# EAGLE design RX621_GREEEEN (EAGLE 5.11)
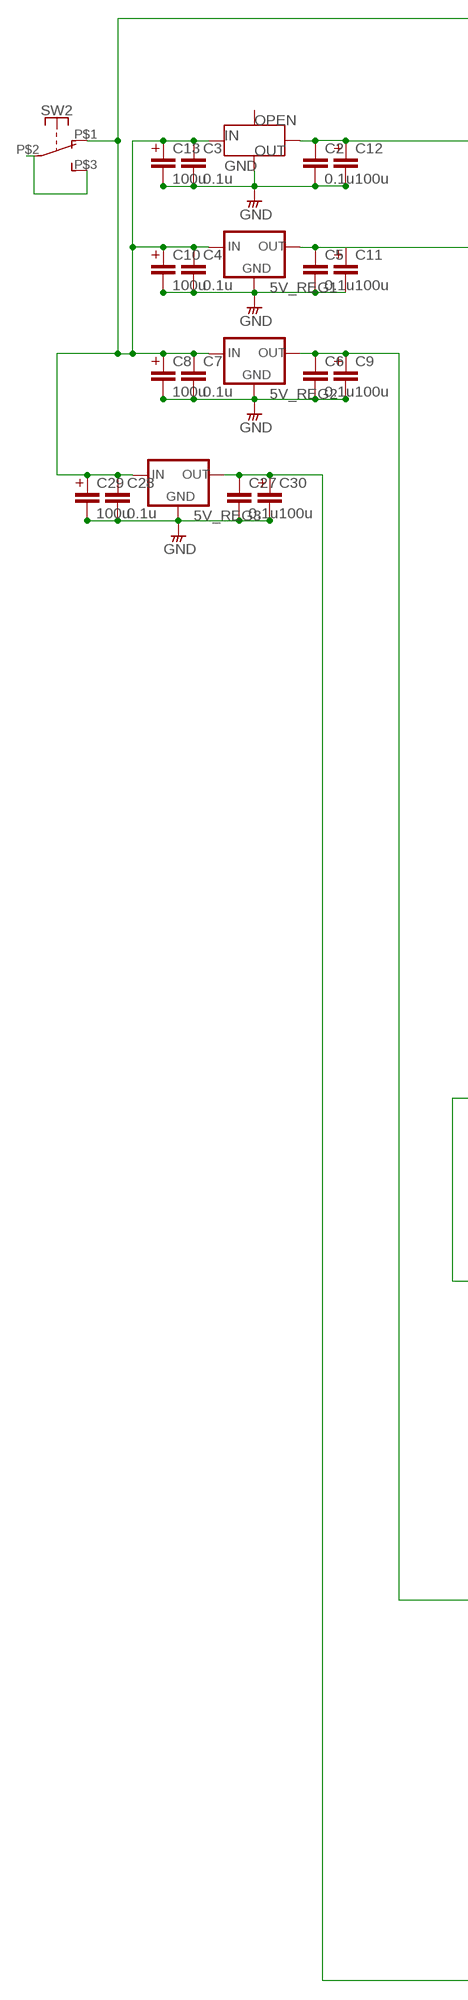
[diagram p0: schematic, sheet 1, part 1 of 2]
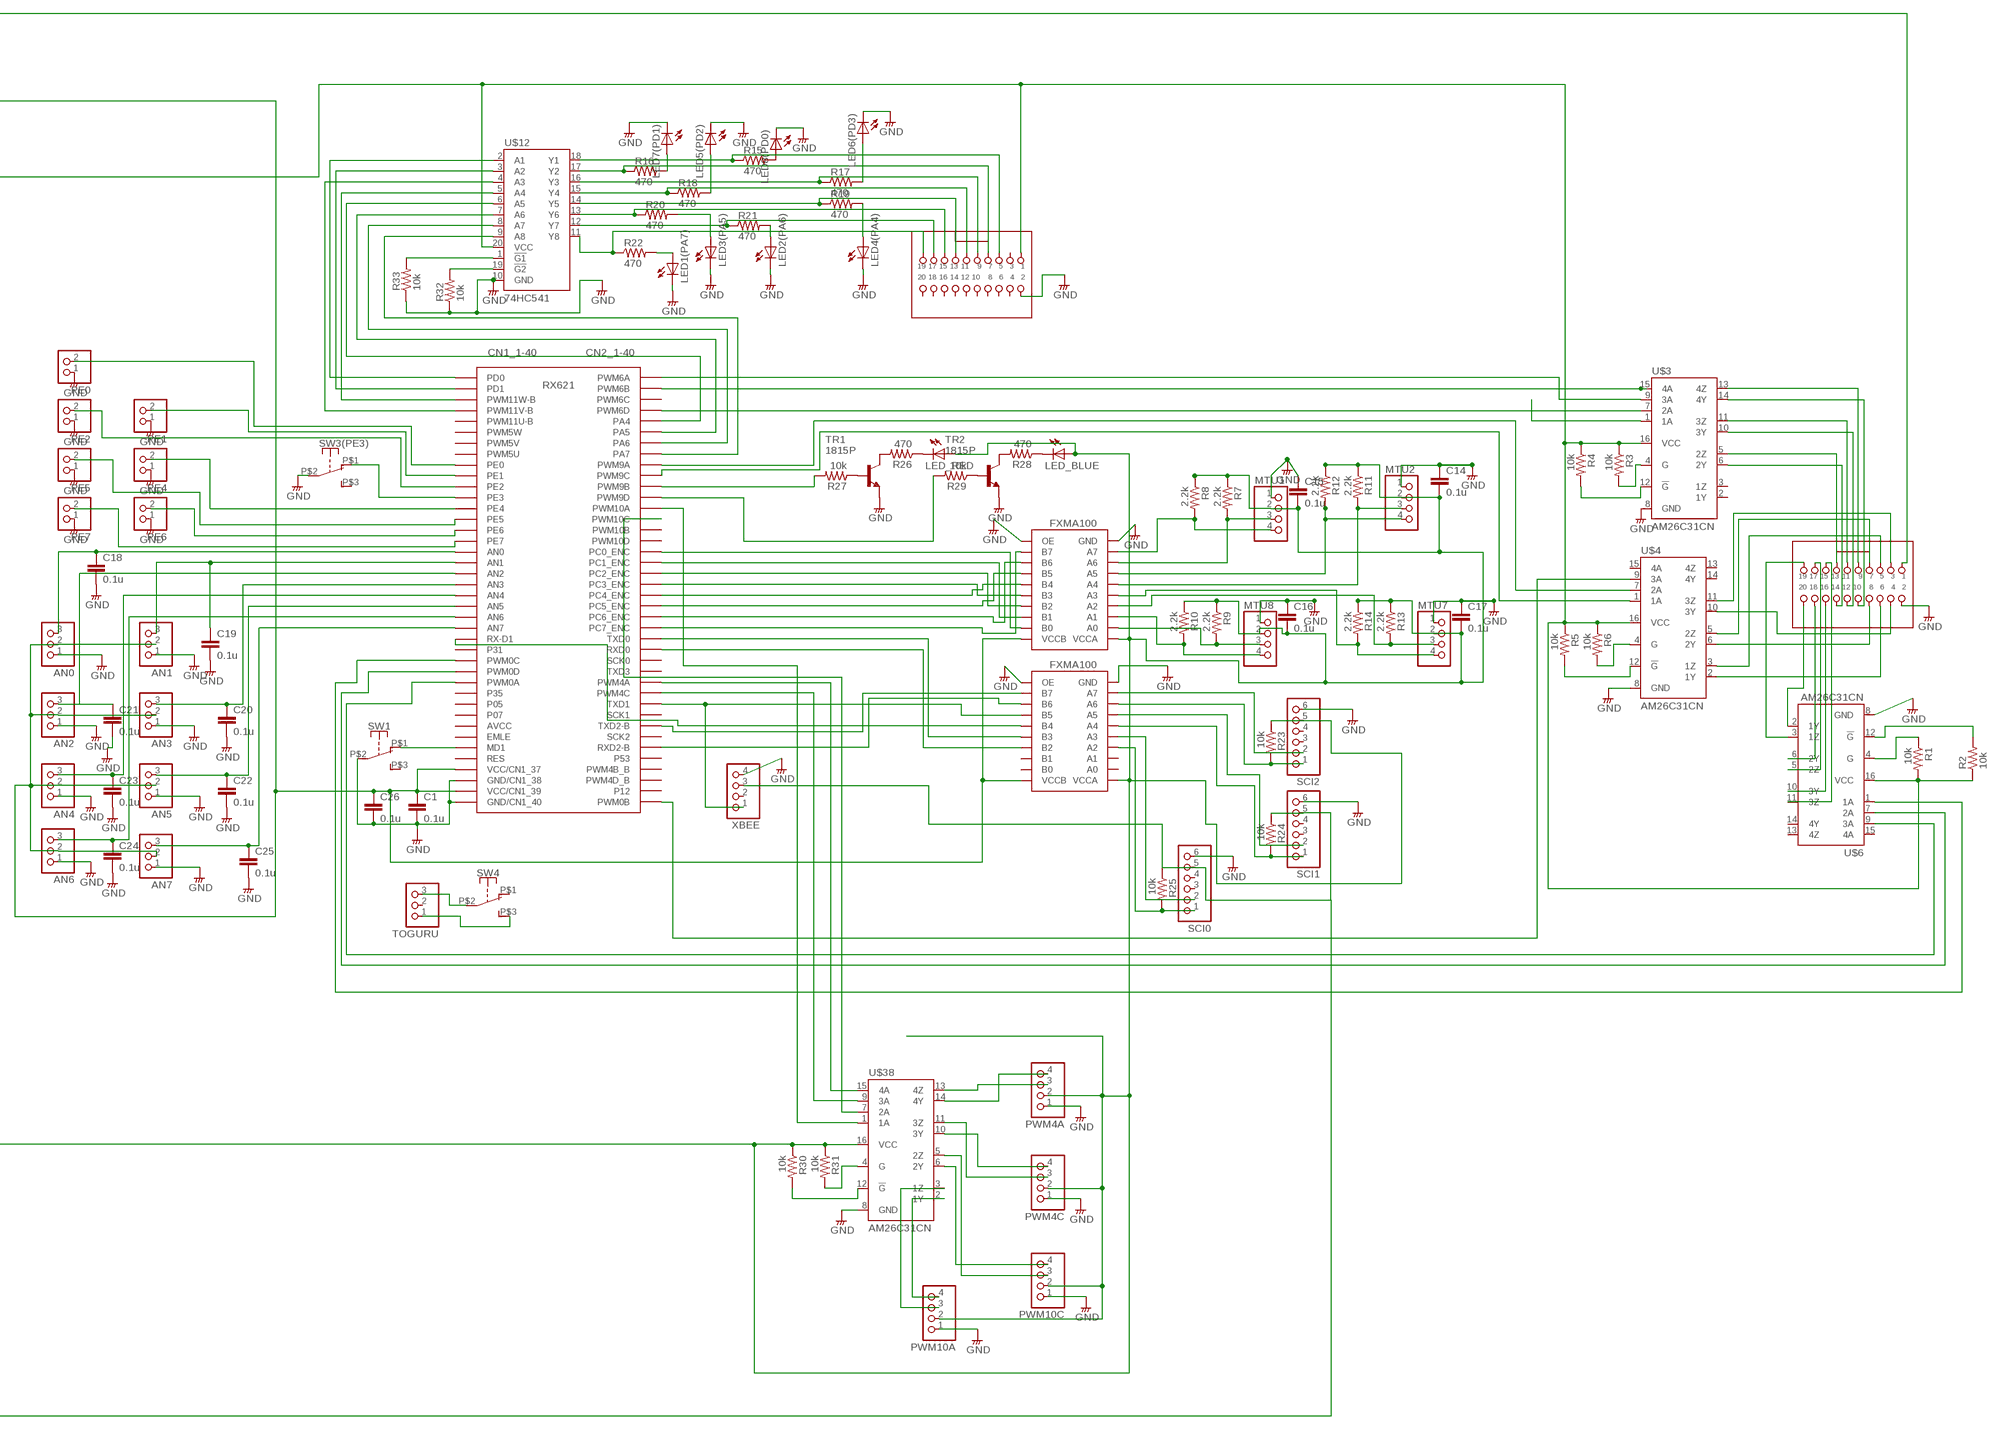
[diagram p1: schematic, sheet 1, part 2 of 2]

## Parts
3.3V_REG  PQ3RD23  [PQ3D23]
5V_REG1  78  [78XX]
5V_REG2  78  [78XX]
5V_REG3  78  [78XX]
AN0  PINHD-1X31*03_P  [1*03_P]
AN1  PINHD-1X31*03_P  [1*03_P]
AN2  PINHD-1X31*03_P  [1*03_P]
AN3  PINHD-1X31*03_P  [1*03_P]
AN4  PINHD-1X31*03_P  [1*03_P]
AN5  PINHD-1X31*03_P  [1*03_P]
AN6  PINHD-1X31*03_P  [1*03_P]
AN7  PINHD-1X31*03_P  [1*03_P]
C1  0.1u  MLCCMLCC_25_P  [MLCC_25_P]
C2  0.1u  MLCC-1  [MLCC_25]
C3  0.1u  MLCC-1  [MLCC_25]
C4  0.1u  MLCC-1  [MLCC_25]
C5  0.1u  MLCC-1  [MLCC_25]
C6  0.1u  MLCC-1  [MLCC_25]
C7  0.1u  MLCC-1  [MLCC_25]
C8  100u  CAPACITOR-2  [C_0.2]
C9  100u  CAPACITOR-2  [C_0.2]
C10  100u  CAPACITOR-2  [C_0.2]
C11  100u  CAPACITOR-2  [C_0.2]
C12  100u  CAPACITOR-2  [C_0.2]
C13  100u  CAPACITOR-2  [C_0.2]
C14  0.1u  MLCCMLCC_25_P  [MLCC_25_P]
C15  0.1u  MLCCMLCC_25_P  [MLCC_25_P]
C16  0.1u  MLCCMLCC_25_P  [MLCC_25_P]
C17  0.1u  MLCCMLCC_25_P  [MLCC_25_P]
C18  0.1u  MLCCMLCC_25_P  [MLCC_25_P]
C19  0.1u  MLCCMLCC_25_P  [MLCC_25_P]
C20  0.1u  MLCCMLCC_25_P  [MLCC_25_P]
C21  0.1u  MLCCMLCC_25_P  [MLCC_25_P]
C22  0.1u  MLCCMLCC_25_P  [MLCC_25_P]
C23  0.1u  MLCCMLCC_25_P  [MLCC_25_P]
C24  0.1u  MLCCMLCC_25_P  [MLCC_25_P]
C25  0.1u  MLCCMLCC_25_P  [MLCC_25_P]
C26  0.1u  MLCCMLCC_25_P  [MLCC_25_P]
C27  0.1u  MLCC-1  [MLCC_25]
C28  0.1u  MLCC-1  [MLCC_25]
C29  100u  CAPACITOR-2  [C_0.2]
C30  100u  CAPACITOR-2  [C_0.2]
LED1(PA7)  LEDLED3MM_P  [LED3MM_P]
LED2(PA6)  LEDLED3MM_P  [LED3MM_P]
LED3(PA5)  LEDLED3MM_P  [LED3MM_P]
LED4(PA4)  LEDLED3MM_P  [LED3MM_P]
LED5(PD2)  LEDLED3MM_P  [LED3MM_P]
LED6(PD3)  LEDLED3MM_P  [LED3MM_P]
LED7(PD1)  LEDLED3MM_P  [LED3MM_P]
LED8(PD0)  LEDLED3MM_P  [LED3MM_P]
LED_BLUE  LED3MM  [LED3MM]
LED_RED  LED3MM  [LED3MM]
MTU1  PINHD-1X41*04_P  [1*04_P]
MTU2  PINHD-1X41*04_P  [1*04_P]
MTU7  PINHD-1X41*04_P  [1*04_P]
MTU8  PINHD-1X41*04_P  [1*04_P]
PE0  PINHD-1X21*02_P  [1*02_P]
PE1  PINHD-1X21*02_P  [1*02_P]
PE2  PINHD-1X21*02_P  [1*02_P]
PE4  PINHD-1X21*02_P  [1*02_P]
PE5  PINHD-1X21*02_P  [1*02_P]
PE6  PINHD-1X21*02_P  [1*02_P]
PE7  PINHD-1X21*02_P  [1*02_P]
PWM4A  PINHD-1X41*04_P  [1*04_P]
PWM4C  PINHD-1X41*04_P  [1*04_P]
PWM10A  PINHD-1X41*04_P  [1*04_P]
PWM10C  PINHD-1X41*04_P  [1*04_P]
R1  10k  RESISTORS  [R_0.2_P]
R2  10k  RESISTORS  [R_0.2_P]
R3  10k  RESISTORSR_0.4_P  [R_0.4_P]
R4  10k  RESISTORSR_0.4_P  [R_0.4_P]
R5  10k  RESISTORSR_0.4_P  [R_0.4_P]
R6  10k  RESISTORSR_0.4_P  [R_0.4_P]
R7  2.2k  RESISTORS  [R_0.2_P]
R8  2.2k  RESISTORS  [R_0.2_P]
R9  2.2k  RESISTORS  [R_0.2_P]
R10  2.2k  RESISTORS  [R_0.2_P]
R11  2.2k  RESISTORS  [R_0.2_P]
R12  2.2k  RESISTORS  [R_0.2_P]
R13  2.2k  RESISTORS  [R_0.2_P]
R14  2.2k  RESISTORS  [R_0.2_P]
R15  470  RESISTORS  [R_0.2_P]
R16  470  RESISTORS  [R_0.2_P]
R17  470  RESISTORS  [R_0.2_P]
R18  470  RESISTORS  [R_0.2_P]
R19  470  RESISTORS  [R_0.2_P]
R20  470  RESISTORS  [R_0.2_P]
R21  470  RESISTORS  [R_0.2_P]
R22  470  RESISTORS  [R_0.2_P]
R23  10k  RESISTORSR_0.4_P  [R_0.4_P]
R24  10k  RESISTORSR_0.4_P  [R_0.4_P]
R25  10k  RESISTORSR_0.4_P  [R_0.4_P]
R26  470  RESISTORS  [R_0.2_P]
R27  10k  RESISTORS  [R_0.2_P]
R28  470  RESISTORS  [R_0.2_P]
R29  10k  RESISTORS  [R_0.2_P]
R30  10k  RESISTORSR_0.4_P  [R_0.4_P]
R31  10k  RESISTORSR_0.4_P  [R_0.4_P]
R32  10k  RESISTORS  [R_0.2_P]
R33  10k  RESISTORS  [R_0.2_P]
SCI0  PINHD-1X61*06_P  [1*06_P]
SCI1  PINHD-1X61*06_P  [1*06_P]
SCI2  PINHD-1X61*06_P  [1*06_P]
SW1  TOGGLE9450-1_P  [9450-1_P]
SW2  TOGGLE9450-1_P  [9450-1_P]
SW3(PE3)  TOGGLE9450-1_P  [9450-1_P]
SW4  TOGGLE9450-1_P  [9450-1_P]
TOGURU  PINHD-1X31*03_P  [1*03_P]
TR1  1815P  [TO92A_P]
TR2  1815P  [TO92A_P]
U$1  RX621_GREEN  [RX621_GREEN]
U$2  OMRON_XG4  [OMRON_XG4]
U$3  AM26C31CN  26C31DIL16_P  [DIL16_P]
U$4  AM26C31CN  26C31DIL16_P  [DIL16_P]
U$6  AM26C31CN  26C31DIL16_P  [DIL16_P]
U$9  FXMA100  [FXMA100]
U$12  74HC541  [DIL20_P]
U$13  OMRON_XG4  [OMRON_XG4]
U$24  FXMA100  [FXMA100]
U$38  AM26C31CN  26C31DIL16_P  [DIL16_P]
XBEE  PINHD-1X41*04_P  [1*04_P]

## Nets
AN2: AN1.3 C19.1 U$1.CN1_18(AN1)
AN3: AN2.3 C21.1 U$1.CN1_19(AN2)
AN6: AN6.3 C24.1 U$1.CN1_23(AN6)
GND: 3.3V_REG.GND(GBD) 5V_REG1.P$2(GND) 5V_REG2.P$2(GND) 5V_REG3.P$2(GND) AN0.1 AN1.1 AN2.1 AN3.1 AN4.1 AN5.1 AN6.1 AN7.1 C1.2 C2.2 C3.2 C4.2 C5.2 C6.2 C7.2 C8.P$2 C9.P$2 C10.P$2 C11.P$2 C12.P$2 C13.P$2 C14.1 C15.1 C16.1 C17.1 C18.2 C19.2 C20.2 C21.2 C22.2 C23.2 C24.2 C25.2 C26.2 C27.2 C28.2 C29.P$2 C30.P$2 LED1(PA7).K(C) LED2(PA6).K(C) LED3(PA5).K(C) LED4(PA4).K(C) LED5(PD2).K(C) LED6(PD3).K(C) LED7(PD1).K(C) LED8(PD0).K(C) MTU1.1 MTU2.1 MTU7.1 MTU8.1 PE0.1 PE1.1 PE2.1 PE4.1 PE5.1 PE6.1 PE7.1 PWM4A.1 PWM4C.1 PWM10A.1 PWM10C.1 R32.1 R33.1 SCI0.6 SCI1.6 SCI2.6 SW1.P$2(P) SW3(PE3).P$2(P) TR1.E TR2.E U$1.CN1_38(GND/CN1_38) U$1.CN1_40(GND/CN1_40) U$2.P$2 U$3.8(GND) U$4.8(GND) U$6.8(GND) U$9.GND U$9.OE U$12.10(GND) U$13.P$2 U$24.GND U$24.OE U$38.8(GND) XBEE.4
N$1: SW1.P$1(O) U$1.CN1_35(MD1)
N$2: U$1.P$13(PWM10A) U$38.1(1A)
N$3: U$1.P$33(TXD2-B) U$24.B7
N$4: 3.3V_REG.OUT AN0.2 AN1.2 AN2.2 AN3.2 AN4.2 AN5.2 AN6.2 AN7.2 C1.1 C2.1 C12.P$1 C26.1 U$1.CN1_37(VCC/CN1_37) U$1.CN1_39(VCC/CN1_39) U$9.VCCB U$24.VCCB
N$5: SW4.P$2(P) TOGURU.3
N$6: PWM10A.3 U$38.3(1Z)
N$7: 5V_REG1.P$3(OUT) C5.1 C11.P$1 R1.2 R2.1 R3.1 R4.1 R5.1 R6.1 U$3.16(VCC) U$4.16(VCC) U$6.16(VCC) U$12.20(VCC) U$13.P$1
N$8: PWM10A.4 U$38.2(1Y)
N$9: SW4.P$3(S) TOGURU.1
N$10: U$3.1(1A)
N$11: SW2.P$2(P) SW2.P$3(S)
N$12: 3.3V_REG.IN 5V_REG1.P$1(IN) 5V_REG2.P$1(IN) 5V_REG3.P$1(IN) C3.1 C4.1 C7.1 C8.P$1 C10.P$1 C13.P$1 C28.1 C29.P$1 SW2.P$1(O) U$2.P$1
N$13: U$2.P$13 U$3.5(2Z)
N$14: U$1.CN1_29(PWM0A) U$6.9(3A)
N$15: U$1.CN1_27(PWM0C) U$6.1(1A)
N$16: U$1.CN1_28(PWM0D) U$6.7(2A)
N$17: U$2.P$17 U$6.5(2Z)
N$18: U$2.P$16 U$6.10(3Y)
N$19: U$2.P$19 U$6.3(1Z)
N$20: U$2.P$20 U$6.2(1Y)
N$21: U$2.P$15 U$6.11(3Z)
N$22: U$2.P$18 U$6.6(2Y)
N$23: U$1.P$9(PWM9A) U$4.7(2A)
N$24: U$1.P$10(PWM9C) U$4.1(1A)
N$27: U$2.P$4 U$4.10(3Y)
N$28: U$2.P$12 U$3.10(3Y)
N$29: U$2.P$11 U$3.11(3Z)
N$30: U$2.P$9 U$3.13(4Z)
N$31: U$1.P$40(PWM0B) U$4.9(3A)
N$32: U$2.P$10 U$3.14(4Y)
N$33: U$2.P$14 U$3.6(2Y)
N$34: U$2.P$6 U$4.2(1Y)
N$35: AN0.3 C18.1 U$1.CN1_17(AN0)
N$36: U$1.P$1(PWM6A) U$3.9(3A)
N$37: U$1.P$2(PWM6B) U$3.15(4A)
N$38: R2.2 U$6.12(!G)
N$39: R1.1 U$6.4(G)
N$41: U$1.P$35(RXD2-B) U$24.B6
N$42: R3.2 U$3.4(G)
N$43: R4.2 U$3.12(!G)
N$44: U$1.P$4(PWM6D) U$3.7(2A)
N$45: U$2.P$5 U$4.3(1Z)
N$46: U$2.P$7 U$4.5(2Z)
N$47: U$1.P$25(TXD0) U$24.B3
N$48: R6.2 U$4.4(G)
N$49: R5.2 U$4.12(!G)
N$50: U$2.P$3 U$4.11(3Z)
N$51: U$1.P$26(RXD0) U$24.B2
N$52: MTU1.3 R7.2 U$9.A6
N$53: MTU1.4 R8.2 U$9.A7
N$55: MTU8.3 R9.2 U$9.A0
N$56: MTU8.4 R10.2 U$9.A1
N$57: MTU2.3 R11.2 U$9.A4
N$58: MTU2.4 R12.2 U$9.A5
N$60: U$1.P$17(PC0_ENC) U$9.B0
N$61: MTU7.3 R13.2 U$9.A2
N$62: MTU7.4 R14.2 U$9.A3
N$64: U$1.P$18(PC1_ENC) U$9.B1
N$65: U$1.P$19(PC2_ENC) U$9.B2
N$66: U$1.P$20(PC3_ENC) U$9.B3
N$67: U$1.P$21(PC4_ENC) U$9.B4
N$68: U$1.P$22(PC5_ENC) U$9.B5
N$69: U$1.P$23(PC6_ENC) U$9.B6
N$70: U$1.P$24(PC7_ENC) U$9.B7
N$71: U$1.CN1_4(PWM11V-B) U$12.4(A3)
N$72: U$1.CN1_3(PWM11W-B) U$12.5(A4)
N$77: U$1.CN1_2(PD1) U$12.3(A2)
N$78: U$1.CN1_1(PD0) U$12.2(A1)
N$79: U$1.P$5(PA4) U$12.6(A5)
N$80: U$1.P$6(PA5) U$12.7(A6)
N$81: U$1.P$7(PA6) U$12.8(A7)
N$82: U$1.P$8(PA7) U$12.9(A8)
N$83: R15.1 U$12.18(Y1) U$13.P$5
N$84: R16.1 U$12.17(Y2) U$13.P$7
N$85: R17.1 U$12.16(Y3) U$13.P$9
N$86: R18.1 U$12.15(Y4) U$13.P$11
N$87: R19.1 U$12.14(Y5) U$13.P$13
N$88: LED1(PA7).A R22.2
N$89: R21.1 U$12.12(Y7) U$13.P$17
N$90: R22.1 U$12.11(Y8) U$13.P$19
N$91: R20.1 U$12.13(Y6) U$13.P$15
N$92: LED2(PA6).A R21.2
N$93: LED7(PD1).A R16.2
N$94: LED8(PD0).A R15.2
N$95: LED4(PA4).A R19.2
N$96: LED6(PD3).A R17.2
N$97: LED5(PD2).A R18.2
N$98: LED3(PA5).A R20.2
N$101: U$1.CN1_25(RX-D1) U$24.B4
N$102: R25.2 SCI0.1 U$24.A2
N$103: U$1.P$31(TXD1) U$24.B5 XBEE.1
N$107: SCI0.2 U$24.A3
N$108: R24.2 SCI1.1 U$24.A4
N$109: R23.2 SCI2.1 U$24.A6
N$110: PE7.2 U$1.CN1_16(PE7)
N$111: PE6.2 U$1.CN1_15(PE6)
N$112: SCI2.2 U$24.A7
N$113: SCI1.2 U$24.A5
N$114: AN3.3 C20.1 U$1.CN1_20(AN3)
N$115: AN4.3 C23.1 U$1.CN1_21(AN4)
N$116: AN5.3 C22.1 U$1.CN1_22(AN5)
N$117: R26.2 TR1.C
N$118: AN7.3 C25.1 U$1.CN1_24(AN7)
N$120: SW3(PE3).P$1(O) U$1.CN1_12(PE3)
N$121: PE4.2 U$1.CN1_13(PE4)
N$122: PE2.2 U$1.CN1_11(PE2)
N$123: PE1.2 U$1.CN1_10(PE1)
N$124: PE0.2 U$1.CN1_9(PE0)
N$125: LED_RED.K(C) R26.1
N$126: R27.1 TR1.B
N$127: R27.2 U$1.P$11(PWM9B)
N$128: LED_BLUE.K(C) R28.1
N$129: R28.2 TR2.C
N$130: R29.1 TR2.B
N$131: R29.2 U$1.P$12(PWM9D)
N$134: U$2.P$8 U$4.6(2Y)
N$135: R31.2 U$38.4(G)
N$136: R30.2 U$38.12(!G)
N$137: U$1.P$29(PWM4A) U$38.15(4A)
N$138: U$1.P$30(PWM4C) U$38.9(3A)
N$140: PWM4C.4 U$38.10(3Y)
N$141: PWM4C.3 U$38.11(3Z)
N$142: PWM4A.4 U$38.14(4Y)
N$143: PWM4A.3 U$38.13(4Z)
N$144: PWM10C.3 U$38.5(2Z)
N$145: PWM10C.4 U$38.6(2Y)
N$146: U$1.P$14(PWM10C) U$38.7(2A)
N$150: R32.2 U$12.19(!G2)
N$151: R33.2 U$12.1(!G1)
PE5: PE5.2 U$1.CN1_14(PE5)
XBEE: 5V_REG2.P$3(OUT) C6.1 C9.P$1 C14.2 C15.2 C16.2 C17.2 LED_BLUE.A LED_RED.A MTU1.2 MTU2.2 MTU7.2 MTU8.2 PWM4A.2 PWM4C.2 PWM10A.2 PWM10C.2 R7.1 R8.1 R9.1 R10.1 R11.1 R12.1 R13.1 R14.1 R23.1 R30.1 R31.1 SCI2.5 U$9.VCCA U$24.VCCA U$38.16(VCC)
XBEE1: 5V_REG3.P$3(OUT) C27.1 C30.P$1 R24.1 R25.1 SCI0.5 SCI1.5 XBEE.3
Unconnected: 3.3V_REG.OPEN SCI0.3 SCI0.4 SCI1.3 SCI1.4 SCI2.3 SCI2.4 SW1.P$3(S) SW3(PE3).P$3(S) SW4.P$1(O) TOGURU.2 U$1.CN1_5(PWM11U-B) U$1.CN1_6(PWM5W) U$1.CN1_7(PWM5V) U$1.CN1_8(PWM5U) U$1.CN1_26(P31) U$1.CN1_30(P35) U$1.CN1_31(P05) U$1.CN1_32(P07) U$1.CN1_33(AVCC) U$1.CN1_34(EMLE) U$1.CN1_36(RES) U$1.P$3(PWM6C) U$1.P$15(PWM10B) U$1.P$16(PWM10D) U$1.P$27(SCK0) U$1.P$28(TXD3) U$1.P$32(SCK1) U$1.P$34(SCK2) U$1.P$36(P53) U$1.P$37(PWM4B_B) U$1.P$38(PWM4D_B) U$1.P$39(P12) U$3.2(1Y) U$3.3(1Z) U$4.13(4Z) U$4.14(4Y) U$4.15(4A) U$6.13(4Z) U$6.14(4Y) U$6.15(4A) U$13.P$3 U$13.P$4 U$13.P$6 U$13.P$8 U$13.P$10 U$13.P$12 U$13.P$14 U$13.P$16 U$13.P$18 U$13.P$20 U$24.A0 U$24.A1 U$24.B0 U$24.B1 XBEE.2

## Library data of the parts
3.3V_REG = regulator_s:PQ3RD23: 4pin
5V_REG1-5V_REG3 = regulator_s:78*: VOLTAGE REGULATOR
AN0 AN1-AN7 TOGURU = pinhead_s:PINHD-1X3: PIN HEADER
C1-C7 C14-C28 = rcl__s:MLCC: CAPACITOR, European symbol
C8-C13 C29 C30 = rcl__s:CAPACITOR
LED1(PA7) LED2(PA6) LED3(PA5) LED4(PA4) LED5(PD2) LED6(PD3) LED7(PD1) LED8(PD0) LED_BLUE LED_RED = LED_s:LED: LED OSRAM: - CHIPLED LG R971, LG N971, LY N971, LG Q971, LY Q971, LO R971, LY R971 LH N974, LH R974 LS Q976, LO Q976, LY Q976 LO Q996 - Hyper CHIPLED LW Q18S LB Q993, LB Q99A, LB R99A - SideLED LS A670, LO A670, LY A670, LG A670, LP A670 LB A673, LV A673, LT A673, LW A673 LH A674 LY A675 LS A676, LA A676, LO A676, LY A676, LW A676 LS A679, LY A679, LG A679 - Hyper Micro SIDELED® LS Y876, LA Y876, LO Y876, LY Y876 LT Y87S - SmartLED LW L88C, LW L88S LB L89C, LB L89S, LG L890 LS L89K, LO L89K, LY L89K LS L896, LA L896, LO L896, LY L896 - TOPLED LS T670, LO T670, LY T670, LG T670, LP T670 LSG T670, LSP T670, LSY T670, LOP T670, LYG T670 LG T671, LOG T671, LSG T671 LB T673, LV T673, LT T673, LW T673 LH T674 LS T676, LA T676, LO T676, LY T676, LB T676, LH T676, LSB T676, LW T676 LB T67C, LV T67C, LT T67C, LS T67K, LO T67K, LY T67K, LW E67C LS E67B, LA E67B, LO E67B, LY E67B, LB E67C, LV E67C, LT E67C LW T67C LS T679, LY T679, LG T679 LS T770, LO T770, LY T770, LG T770, LP T770 LB T773, LV T773, LT T773, LW T773 LH T774 LS E675, LA E675, LY E675, LS T675 LS T776, LA T776, LO T776, LY T776, LB T776 LHGB T686 LT T68C, LB T68C - Hyper Mini TOPLED® LB M676 - Mini TOPLED Santana® LG M470 LS M47K, LO M47K, LY M47K Source: http://www.osram.convergy.de - LUMILED® LXK2-PW12-R00, LXK2-PW12-S00, LXK2-PW14-U00, LXK2-PW14-V00 LXK2-PM12-R00, LXK2-PM12-S00, LXK2-PM14-U00 LXK2-PE12-Q00, LXK2-PE12-R00, LXK2-PE12-S00, LXK2-PE14-T00, LXK2-PE14-U00 LXK2-PB12-K00, LXK2-PB12-L00, LXK2-PB12-M00, LXK2-PB14-N00, LXK2-PB14-P00, LXK2-PB14-Q00 LXK2-PR12-L00, LXK2-PR12-M00, LXK2-PR14-Q00, LXK2-PR14-R00 LXK2-PD12-Q00, LXK2-PD12-R00, LXK2-PD12-S00 LXK2-PH12-R00, LXK2-PH12-S00 LXK2-PL12-P00, LXK2-PL12-Q00, LXK2-PL12-R00 Source: www.luxeon.com
MTU1 MTU2 MTU7 MTU8 PWM4A PWM4C PWM10A PWM10C XBEE = pinhead_s:PINHD-1X4: PIN HEADER
PE0 PE1 PE2 PE4-PE7 = pinhead_s:PINHD-1X2: PIN HEADER
R1-R33 = rcl__s:RESISTORS
SCI0 SCI1 SCI2 = pinhead_s:PINHD-1X6: PIN HEADER
SW1 SW2 SW3(PE3) SW4 = switch_s:TOGGLE
TR1 TR2 = transistor_s:1815: NPN Transistor
U$1 = RX621_GREEN:RX621_GREEN: OK
U$2 U$13 = pinhead_s:OMRON_XG4: OK
U$3 U$4 U$6 U$38 = line_driver:26C31
U$9 U$24 = level_convert:FXMA100: level convert IC (FXMA100)
U$12 = 74hc:74HC541

## Board
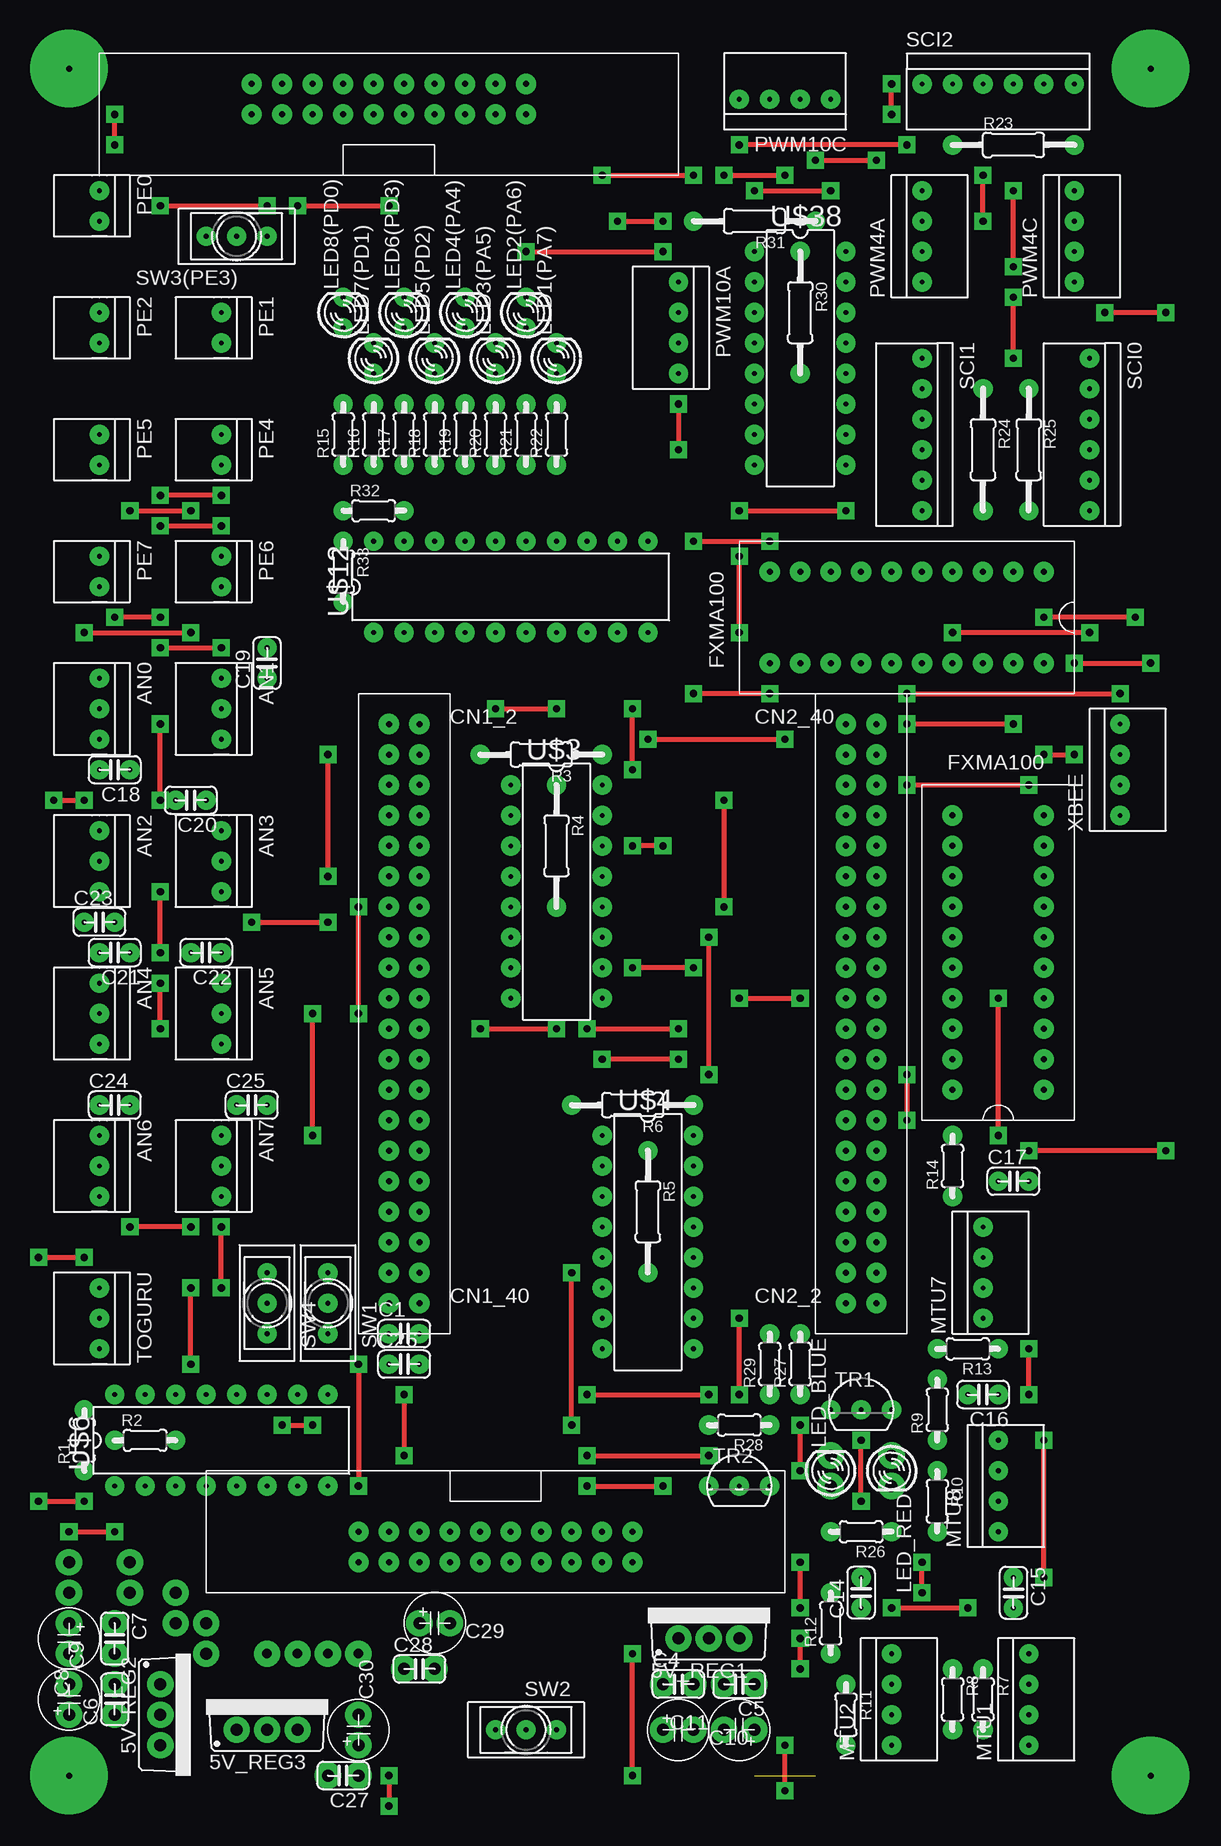
[diagram p2: board, top side]
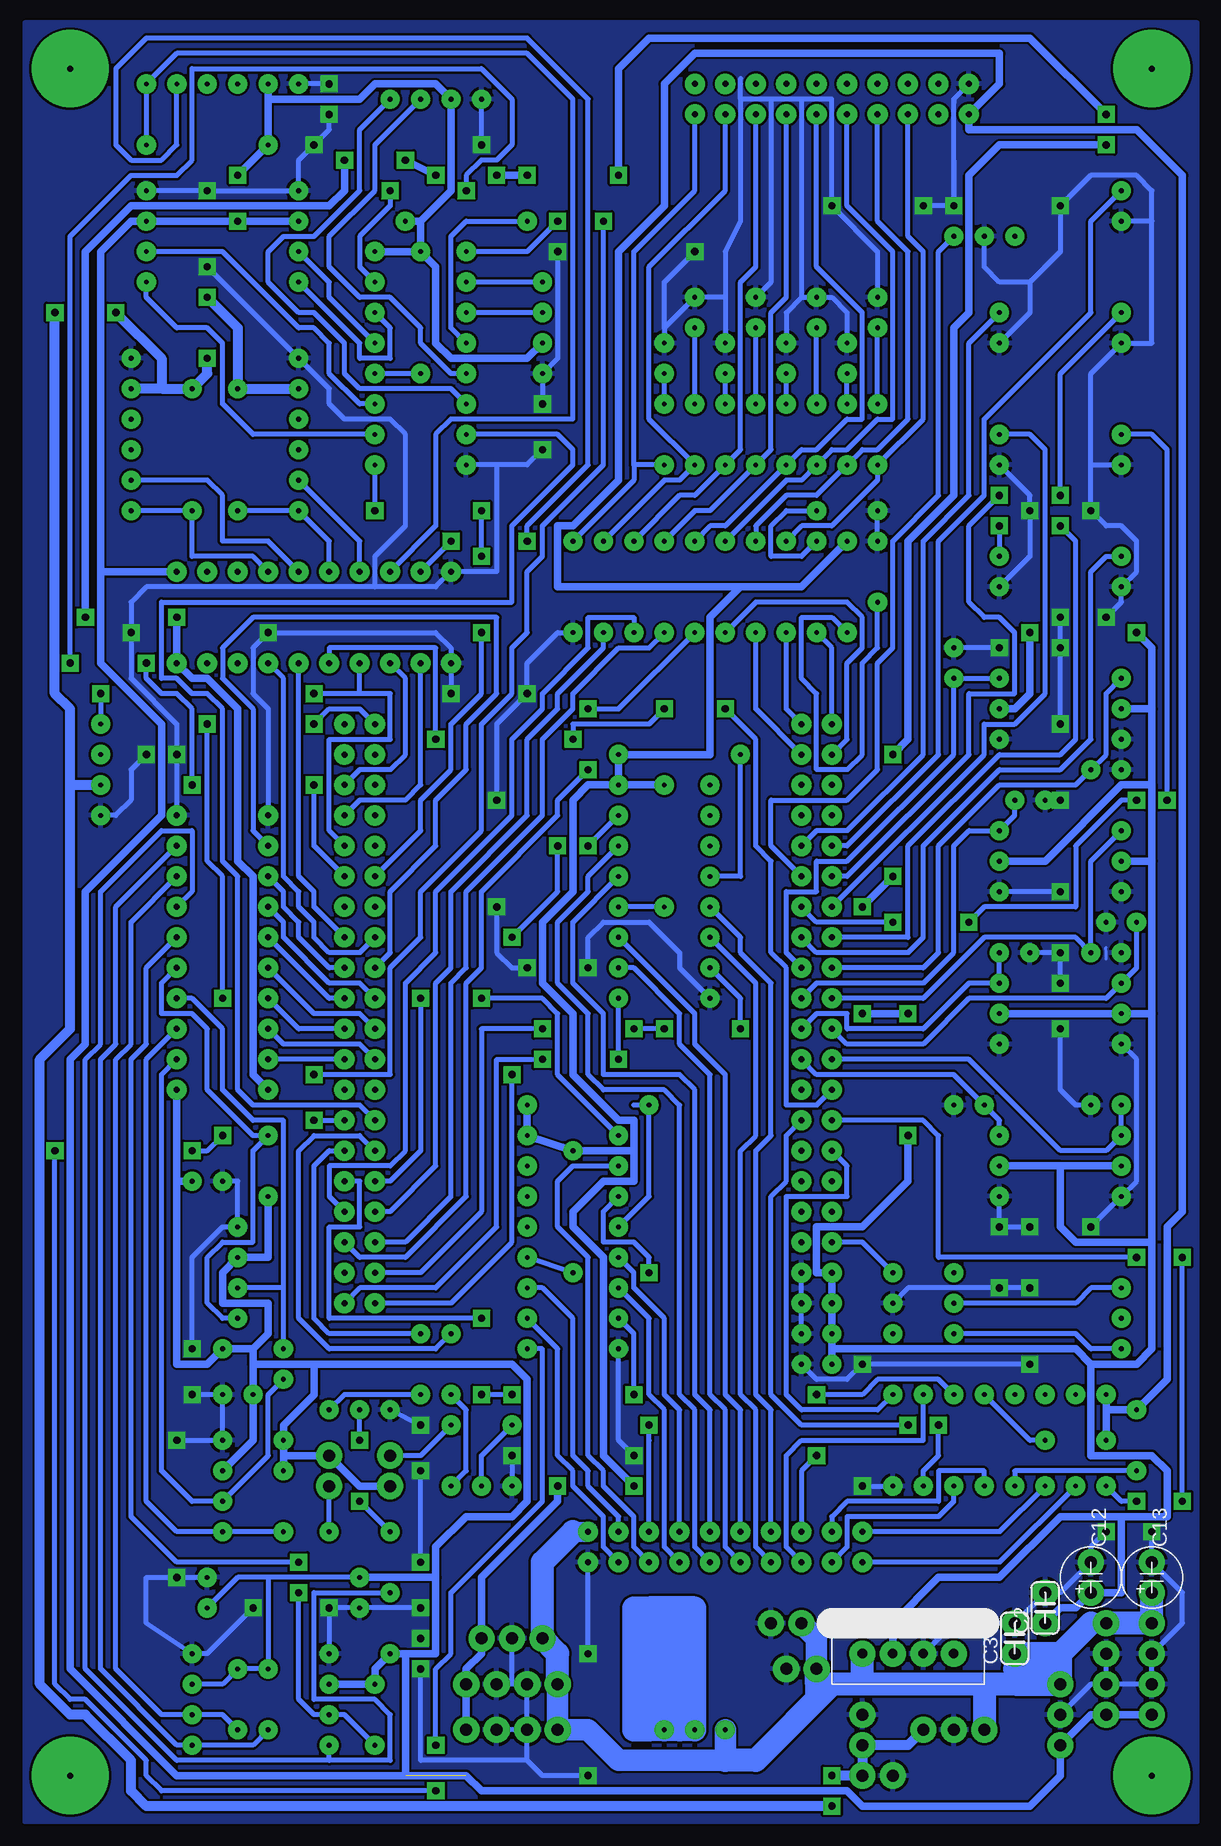
[diagram p3: board, bottom side, seen from below]

No outline drawn. Coordinates in mm, seen from the top.
Copper layers (1*16): Top 0.035mm / dielectric 1.5mm / Bottom 0.035mm
Design rules "default": minimum track width 10mil, minimum drill 24mil, track to track 8mil, track to pad 8mil, pad to pad 8mil, via to via 8mil, smd to smd 8mil, copper to edge 40mil, drill to drill 8mil, minimum pad ring 10mil, minimum via ring 8mil, stop-mask expansion 4mil, vias tented up to drill 0mil, thermal gap 10mil

### Footprints (pad centres in the part's own frame; a part is rotated, then mirrored left to right if it is on the bottom)
PQ3D23 = drill 0.8 pad 2.184 round: GND 5.08,0; IN 0,0; OPEN 7.62,0; OUT 2.54,0
78XX = drill 1 pad 2.184 round: P$1 -2.54,0; P$2 0,0; P$3 2.54,0
1*03_P = drill 0.4 pad 1.6 round: 1 2.54,0; 2 0,0; 3 -2.54,0
MLCC_25_P = drill 0.4 pad 1.6 round: 1 -1.27,0; 2 1.27,0
MLCC_25 = drill 1 pad 2.184 round: 1 -1.27,0; 2 1.27,0
C_0.2 = drill 1 pad 2.184 round: P$1 -1.27,0; P$2 1.27,0
LED3MM_P = drill 0.4 pad 1.6 round: A -1.27,0; K 1.27,0
LED3MM = drill 1 pad 2.184 round: A -1.27,0; K 1.27,0
1*04_P = drill 0.4 pad 1.6 round: 1 5.08,0; 2 2.54,0; 3 0,0; 4 -2.54,0
1*02_P = drill 0.4 pad 1.6 round: 1 1.27,0; 2 -1.27,0
R_0.2_P = drill 0.4 pad 1.6 round: 1 -2.54,0; 2 2.54,0
R_0.4_P = drill 0.4 pad 1.6 round: 1 -5.08,0; 2 5.08,0
1*06_P = drill 0.4 pad 1.6 round: 1 6.35,0; 2 3.81,0; 3 1.27,0; 4 -1.27,0; 5 -3.81,0; 6 -6.35,0
9450-1_P = drill 0.4 pad 1.6 round: P$1 -2.54,0; P$2 0,0; P$3 2.54,0
TO92A_P = drill 0.4 pad 1.6 round: B 2.54,0; C 0,0; E -2.54,0
RX621_GREEN = drill 0.5 pad 1.676 round: CN1_1 2.54,0; CN1_2 5.08,0; CN1_3 2.54,-2.54; CN1_4 5.08,-2.54; CN1_5 2.54,-5.08; CN1_6 5.08,-5.08; CN1_7 2.54,-7.62; CN1_8 5.08,-7.62; CN1_9 2.54,-10.16; CN1_10 5.08,-10.16; CN1_11 2.54,-12.7; CN1_12 5.08,-12.7; CN1_13 2.54,-15.24; CN1_14 5.08,-15.24; CN1_15 2.54,-17.78; CN1_16 5.08,-17.78; CN1_17 2.54,-20.32; CN1_18 5.08,-20.32; CN1_19 2.54,-22.86; CN1_20 5.08,-22.86; CN1_21 2.54,-25.4; CN1_22 5.08,-25.4; CN1_23 2.54,-27.94; CN1_24 5.08,-27.94; CN1_25 2.54,-30.48; CN1_26 5.08,-30.48; CN1_27 2.54,-33.02; CN1_28 5.08,-33.02; CN1_29 2.54,-35.56; CN1_30 5.08,-35.56; CN1_31 2.54,-38.1; CN1_32 5.08,-38.1; CN1_33 2.54,-40.64; CN1_34 5.08,-40.64; CN1_35 2.54,-43.18; CN1_36 5.08,-43.18; CN1_37 2.54,-45.72; CN1_38 5.08,-45.72; CN1_39 2.54,-48.26; CN1_40 5.08,-48.26; P$1 43.18,-48.26; P$2 40.64,-48.26; P$3 43.18,-45.72; P$4 40.64,-45.72; P$5 43.18,-43.18; P$6 40.64,-43.18; P$7 43.18,-40.64; P$8 40.64,-40.64; P$9 43.18,-38.1; P$10 40.64,-38.1; P$11 43.18,-35.56; P$12 40.64,-35.56; P$13 43.18,-33.02; P$14 40.64,-33.02; P$15 43.18,-30.48; P$16 40.64,-30.48; P$17 43.18,-27.94; P$18 40.64,-27.94; P$19 43.18,-25.4; P$20 40.64,-25.4; P$21 43.18,-22.86; P$22 40.64,-22.86; P$23 43.18,-20.32; P$24 40.64,-20.32; P$25 43.18,-17.78; P$26 40.64,-17.78; P$27 43.18,-15.24; P$28 40.64,-15.24; P$29 43.18,-12.7; P$30 40.64,-12.7; P$31 43.18,-10.16; P$32 40.64,-10.16; P$33 43.18,-7.62; P$34 40.64,-7.62; P$35 43.18,-5.08; P$36 40.64,-5.08; P$37 43.18,-2.54; P$38 40.64,-2.54; P$39 43.18,0; P$40 40.64,0
OMRON_XG4 = drill 0.5 pad 1.676 round: P$1 10.16,5.08; P$2 10.16,2.54; P$3 7.62,5.08; P$4 7.62,2.54; P$5 5.08,5.08; P$6 5.08,2.54; P$7 2.54,5.08; P$8 2.54,2.54; P$9 0,5.08; P$10 0,2.54; P$11 -2.54,5.08; P$12 -2.54,2.54; P$13 -5.08,5.08; P$14 -5.08,2.54; P$15 -7.62,5.08; P$16 -7.62,2.54; P$17 -10.16,5.08; P$18 -10.16,2.54; P$19 -12.7,5.08; P$20 -12.7,2.54
DIL16_P = drill 0.4 pad 1.6 round: 1 -3.81,8.89; 2 -3.81,6.35; 3 -3.81,3.81; 4 -3.81,1.27; 5 -3.81,-1.27; 6 -3.81,-3.81; 7 -3.81,-6.35; 8 -3.81,-8.89; 9 3.81,-8.89; 10 3.81,-6.35; 11 3.81,-3.81; 12 3.81,-1.27; 13 3.81,1.27; 14 3.81,3.81; 15 3.81,6.35; 16 3.81,8.89
FXMA100 = drill 0.5 pad 1.676 round: A0 0,-2.54; A1 0,-5.08; A2 0,-7.62; A3 0,-10.16; A4 0,-12.7; A5 0,-15.24; A6 0,-17.78; A7 0,-20.32; B0 7.62,-2.54; B1 7.62,-5.08; B2 7.62,-7.62; B3 7.62,-10.16; B4 7.62,-12.7; B5 7.62,-15.24; B6 7.62,-17.78; B7 7.62,-20.32; GND 0,-22.86; OE 7.62,-22.86; VCCA 0,0; VCCB 7.62,0
DIL20_P = drill 0.4 pad 1.6 round: 1 -3.81,11.43; 2 -3.81,8.89; 3 -3.81,6.35; 4 -3.81,3.81; 5 -3.81,1.27; 6 -3.81,-1.27; 7 -3.81,-3.81; 8 -3.81,-6.35; 9 -3.81,-8.89; 10 -3.81,-11.43; 11 3.81,-11.43; 12 3.81,-8.89; 13 3.81,-6.35; 14 3.81,-3.81; 15 3.81,-1.27; 16 3.81,1.27; 17 3.81,3.81; 18 3.81,6.35; 19 3.81,8.89; 20 3.81,11.43

### Placement (x,y rotation side)
3.3V_REG  27.94,13.97 0 bottom
5V_REG1  57.15,15.24 0 top
5V_REG2  11.43,8.89 270 top
5V_REG3  20.32,7.62 0 top
AN0  6.35,92.71 270 top
AN1  16.51,92.71 270 top
AN2  6.35,80.01 270 top
AN3  16.51,80.01 270 top
AN4  6.35,67.31 270 top
AN5  16.51,67.31 270 top
AN6  6.35,54.61 270 top
AN7  16.51,54.61 270 top
C1  31.75,40.64 0 top
C2  12.7,17.78 90 bottom
C3  15.24,15.24 90 bottom
C4  54.61,11.43 0 top
C5  59.69,11.43 180 top
C6  7.62,10.16 90 top
C7  7.62,15.24 270 top
C8  3.81,15.24 270 top
C9  3.81,10.16 90 top
C10  54.61,7.62 0 top
C11  59.69,7.62 180 top
C12  8.89,20.32 90 bottom
C13  3.81,20.32 90 bottom
C14  69.85,19.05 90 top
C15  82.55,19.05 270 top
C16  80.01,35.56 180 top
C17  82.55,53.34 0 top
C18  7.62,87.63 180 top
C19  20.32,96.52 90 top
C20  13.97,85.09 180 top
C21  7.62,72.39 180 top
C22  15.24,72.39 180 top
C23  6.35,74.93 0 top
C24  7.62,59.69 0 top
C25  19.05,59.69 0 top
C26  31.75,38.1 0 top
C27  26.67,3.81 180 top
C28  33.02,12.7 0 top
C29  34.29,16.51 0 top
C30  27.94,7.62 90 top
LED1(PA7)  44.45,121.92 90 top
LED2(PA6)  41.91,125.73 90 top
LED3(PA5)  39.37,121.92 90 top
LED4(PA4)  36.83,125.73 90 top
LED5(PD2)  34.29,121.92 90 top
LED6(PD3)  31.75,125.73 90 top
LED7(PD1)  29.21,121.92 90 top
LED8(PD0)  26.67,125.73 90 top
LED_BLUE  67.31,29.21 90 top
LED_RED  72.39,29.21 270 top
MTU1  83.82,8.89 90 top
MTU2  72.39,8.89 90 top
MTU7  80.01,44.45 90 top
MTU8  81.28,26.67 90 top
PE0  6.35,134.62 270 top
PE1  16.51,124.46 270 top
PE2  6.35,124.46 270 top
PE4  16.51,114.3 270 top
PE5  6.35,114.3 270 top
PE6  16.51,104.14 270 top
PE7  6.35,104.14 270 top
PWM4A  74.93,130.81 90 top
PWM4C  87.63,130.81 90 top
PWM10A  54.61,125.73 270 top
PWM10C  64.77,143.51 180 top
R1  5.08,31.75 90 top
R2  10.16,31.75 0 top
R3  43.18,88.9 180 top
R4  44.45,81.28 270 top
R5  52.07,50.8 270 top
R6  50.8,59.69 180 top
R7  80.01,10.16 270 top
R8  77.47,10.16 270 top
R9  76.2,34.29 90 top
R10  76.2,26.67 270 top
R11  68.58,8.89 270 top
R12  67.31,16.51 90 top
R13  78.74,39.37 180 top
R14  77.47,54.61 90 top
R15  26.67,115.57 90 top
R16  29.21,115.57 90 top
R17  31.75,115.57 90 top
R18  34.29,115.57 90 top
R19  36.83,115.57 90 top
R20  39.37,115.57 90 top
R21  41.91,115.57 90 top
R22  44.45,115.57 90 top
R23  82.55,139.7 0 top
R24  80.01,114.3 270 top
R25  83.82,114.3 270 top
R26  69.85,24.13 180 top
R27  64.77,38.1 90 top
R28  59.69,33.02 180 top
R29  62.23,38.1 90 top
R30  64.77,125.73 270 top
R31  60.96,133.35 180 top
R32  29.21,109.22 0 top
R33  26.67,104.14 270 top
SCI0  88.9,115.57 270 top
SCI1  74.93,115.57 270 top
SCI2  81.28,144.78 0 top
SW1  25.4,43.18 270 top
SW2  41.91,7.62 0 top
SW3(PE3)  17.78,132.08 180 top
SW4  20.32,43.18 270 top
TOGURU  6.35,41.91 270 top
TR1  69.85,34.29 0 top
TR2  59.69,27.94 0 top
U$1  27.94,91.44 0 top
U$2  40.64,19.05 0 top
U$3  44.45,77.47 0 top
U$4  52.07,48.26 0 top
U$6  16.51,31.75 90 top
U$9  85.09,60.96 180 top
U$12  40.64,102.87 90 top
U$13  29.21,147.32 180 top
U$24  85.09,104.14 270 top
U$38  64.77,121.92 0 top
XBEE  91.44,86.36 90 top

### Tracks (layer width: path | path; a pad name or v marks a point on that pad's centre or on a via)
AN2
  Bottom 0.406: U$1.CN1_18 34.29,72.39 34.29,77.47 31.75,77.47 31.75,80.01 29.21,80.01 20.32,88.9 C19.1 AN1.3
AN3
  Bottom 0.406: U$1.CN1_19 22.86,68.58 17.78,73.66 10.16,73.66 C21.1 8.89,80.01 AN2.3
AN6
  Bottom 0.406: U$1.CN1_23 19.05,63.5 11.43,55.88 7.62,55.88 AN6.3 C24.1
GND  (via drill 0.6 pad 1.42)
  Top 0.406: v64.77,29.21 v64.77,33.02 | v64.77,17.78 v64.77,21.59 | v50.8,3.81 v50.8,13.97 | v13.97,49.53 v8.89,49.53 | v72.39,142.24 v72.39,144.78 | v82.55,129.54 v82.55,135.89 | v88.9,99.06 v77.47,99.06 | v8.89,109.22 v13.97,109.22 | v62.23,93.98 v55.88,93.98 | v64.77,12.7 v64.77,15.24 | v46.99,30.48 v57.15,30.48 | v85.09,20.32 v85.09,31.75 | v72.39,17.78 v78.74,17.78 | v11.43,134.62 v20.32,134.62 | v22.86,134.62 v30.48,134.62 | v3.81,24.13 v7.62,24.13 | v54.61,118.11 v54.61,114.3 | v41.91,130.81 v53.34,130.81 | v11.43,85.09 v11.43,91.44 | v11.43,97.79 v16.51,97.79 | v13.97,38.1 v13.97,44.45 | v27.94,38.1 v27.94,27.94 | v11.43,66.04 v11.43,69.85 | v11.43,100.33 v7.62,100.33 | v11.43,72.39 v11.43,77.47 | v16.51,44.45 v16.51,49.53 | v58.42,85.09 v58.42,76.2 | v55.88,71.12 v50.8,71.12 | v83.82,35.56 v83.82,39.37 | v85.09,88.9 v87.63,88.9 | v73.66,139.7 v59.69,139.7
  Bottom 0.254: 7.64,72.8 7.62,72.39 7.61,71.87
  Bottom 0.406: v64.77,21.59 v64.77,29.21 | v64.77,33.02 TR1.E | v50.8,13.97 U$2.P$2 | v50.8,3.81 54.61,3.81 55.88,5.08 | 55.88,5.08 C10.P$2 | v8.89,49.53 AN6.1 5.08,53.34 5.08,63.5 AN4.1 | AN7.1 v16.51,49.53 v13.97,49.53 | v72.39,144.78 SCI2.6 | v72.39,142.24 72.39,140.97 v73.66,139.7 74.93,138.43 PWM4A.1 v82.55,135.89 PWM4C.1 | v82.55,129.54 SCI1.6 72.39,119.38 72.39,118.11 71.12,116.84 67.31,116.84 66.04,115.57 66.04,107.95 68.58,105.41 68.58,102.87 | U$9.OE 77.47,92.71 78.74,93.98 78.74,97.79 v77.47,99.06 63.5,99.06 62.23,97.79 U$24.OE v62.23,93.98 | U$9.GND v85.09,88.9 85.09,91.44 88.9,95.25 v88.9,99.06 88.9,101.6 87.63,102.87 63.5,102.87 U$24.GND 58.42,104.14 58.42,113.03 | 8.89,113.03 v8.89,109.22 7.62,107.95 6.35,107.95 5.08,106.68 5.08,104.14 PE7.1 6.35,101.6 v7.62,100.33 | PE4.1 13.97,110.49 v13.97,109.22 13.97,105.41 PE6.1 | U$12.10 53.34,99.06 55.88,96.52 v55.88,93.98 58.42,91.44 v58.42,85.09 | 55.88,5.08 64.77,5.08 v64.77,12.7 | v46.99,30.48 48.26,31.75 U$4.8 | v57.15,30.48 TR2.E | v85.09,31.75 MTU8.1 C16.1 v83.82,35.56 | v78.74,17.78 82.55,13.97 MTU1.1 87.63,16.51 87.63,20.32 v85.09,20.32 C15.1 | v72.39,17.78 C14.1 v64.77,17.78 v72.39,17.78 | SW3(PE3).P$2 17.78,129.54 16.51,128.27 13.97,128.27 | 13.97,128.27 11.43,130.81 v11.43,134.62 8.89,137.16 5.08,137.16 3.81,135.89 3.81,133.35 | v22.86,134.62 v20.32,134.62 20.32,138.43 | LED8(PD0).K 26.67,130.81 v30.48,134.62 30.48,143.51 33.02,143.51 | v3.81,24.13 C13.P$2 1.27,19.05 1.27,16.51 C8.P$2 C9.P$2 C6.2 | 20.32,138.43 20.32,143.51 | 20.32,143.51 20.35,142.76 | 20.32,138.43 20.32,134.8 | 38.1,143.51 38.1,142.24 | 38.1,143.51 38.1,144.78 38.1,145.23
  Bottom 0.406: 38.1,142.24 38.1,141.79 | 35.56,143.51 38.1,143.51 | 35.56,143.51 35.56,142.24 | 35.56,142.24 35.56,141.79 | 33.02,143.51 35.56,143.51 | 33.02,143.51 33.02,142.24 | 33.02,142.24 33.02,141.79 | 39.37,127 LED3(PA5).K | 39.37,127 LED2(PA6).K 44.45,124.46 | 44.45,124.46 LED1(PA7).K | 33.02,142.24 33.02,127 | LED7(PD1).K 29.21,125.73 30.48,127 LED6(PD3).K 33.02,127 | 33.02,127 34.29,125.73 LED5(PD2).K | LED4(PA4).K 35.56,128.27 35.56,142.24 | 39.37,127 39.37,130.81 38.1,133.35 38.1,142.24 | 20.32,143.51 U$13.P$2 | PE1.1 13.97,125.73 13.97,128.27 | 3.81,133.35 PE0.1 | 8.89,113.03 PE5.1 | 8.89,113.03 8.89,120.65 PE2.1 3.81,123.19 3.81,133.35 | R33.1 R32.1 | C17.1 80.01,53.34 MTU7.1 81.28,49.53 83.82,46.99 v83.82,39.37 | C1.2 U$1.CN1_40 U$1.CN1_38 | 57.15,11.43 C5.2 | 57.15,11.43 C4.2 C10.P$2 | 57.15,11.43 5V_REG1.P$2 | v72.39,17.78 MTU2.1 | C10.P$2 C11.P$2 | 3.3V_REG.GND 20.32,16.51 C3.2 C2.2 11.43,19.05 C12.P$2 8.89,22.86 v7.62,24.13 | C6.2 C7.2 | C6.2 8.89,11.43 5V_REG2.P$2 | v54.61,118.11 PWM10A.1 53.34,121.92 v53.34,130.81 | v54.61,114.3 55.88,113.03 58.42,113.03 | 58.42,113.03 U$38.8 | 44.45,124.46 44.45,128.27 v41.91,130.81 | v11.43,85.09 C20.2 | v11.43,91.44 v11.43,97.79 v11.43,100.33 | v16.51,97.79 C19.2 | C26.2 31.75,36.83 29.21,36.83 v27.94,38.1 v13.97,38.1 | v13.97,44.45 v16.51,44.45 24.13,44.45 SW1.P$2 | v27.94,27.94 U$6.8 | C24.2 10.16,59.69 11.43,60.96 v11.43,66.04 | v11.43,69.85 v11.43,72.39 C22.2 | v11.43,77.47 AN3.1 | v58.42,76.2 58.42,72.39 57.15,71.12 v55.88,71.12 | v50.8,71.12 50.8,73.66 49.53,74.93 45.72,74.93 43.18,72.39 43.18,71.12 U$3.8 | v87.63,88.9 88.9,87.63 88.9,85.09 90.17,83.82 XBEE.4 | v59.69,139.7 PWM10C.1
  pour Bottom: 0,149.86 97.79,149.86 97.79,0 0,0
N$1
  Bottom 0.406: SW1.P$1 27.94,48.26 U$1.CN1_35
N$2  (via drill 0.6 pad 1.42)
  Top 0.406: v73.66,62.23 v73.66,58.42 | v49.53,133.35 v53.34,133.35
  Bottom 0.406: v73.66,58.42 U$1.P$13 | v73.66,62.23 67.31,62.23 67.31,71.12 64.77,73.66 64.77,77.47 59.69,82.55 59.69,91.44 57.15,93.98 57.15,97.79 55.88,99.06 55.88,104.14 54.61,105.41 54.61,107.95 49.53,113.03 v49.53,133.35 | v53.34,133.35 55.88,130.81 U$38.1
N$3
  Bottom 0.406: U$24.B7 64.77,86.36 66.04,85.09 69.85,85.09 U$1.P$33
N$4  (via drill 0.6 pad 1.42)
  Top 0.406: v5.08,99.06 v13.97,99.06 | v92.71,100.33 v85.09,100.33 | v66.04,138.43 v71.12,138.43 | v58.42,137.16 v63.5,137.16 | v48.26,137.16 v55.88,137.16 | v7.62,139.7 v7.62,142.24 | v25.4,78.74 v25.4,88.9 | v27.94,67.31 v27.94,76.2 | v24.13,57.15 v24.13,67.31
  Bottom 0.61: U$9.VCCB 78.74,62.23 78.74,78.74 80.01,80.01 80.01,92.71 82.55,95.25 83.82,95.25 U$24.VCCB v85.09,100.33 | 3.81,80.01 AN2.2 | 3.81,86.36 3.81,92.71 | 3.81,80.01 3.81,86.36 | 3.81,92.71 AN0.2 | AN3.2 12.7,80.01 6.35,86.36 3.81,86.36 | AN1.2 15.24,92.71 13.97,93.98 v13.97,99.06 | v5.08,99.06 3.81,97.79 3.81,92.71 | 3.81,67.31 AN4.2 AN5.2 | 3.81,67.31 3.81,80.01 | C2.1 11.43,17.78 10.16,17.78 C12.P$1 6.35,19.05 6.35,25.4 | 3.3V_REG.OUT 25.4,16.51 21.59,20.32 16.51,20.32 11.43,25.4 6.35,25.4 | 30.48,39.37 C1.1 U$1.CN1_39 U$1.CN1_37 31.75,45.72 31.75,49.53 27.94,49.53 24.13,53.34 v24.13,57.15 | 11.43,54.61 AN7.2 | 6.35,25.4 2.54,25.4 2.54,29.21 3.81,30.48 8.89,30.48 8.89,38.1 | 3.81,48.26 3.81,67.31 | 11.43,54.61 AN6.2 | v92.71,100.33 92.71,130.81 88.9,134.62 72.39,134.62 71.12,135.89 v71.12,138.43 | v63.5,137.16 v66.04,138.43 | v55.88,137.16 v58.42,137.16 | v48.26,137.16 48.26,146.05 45.72,148.59 13.97,148.59 v7.62,142.24 | v7.62,139.7 16.51,139.7 19.05,137.16 19.05,125.73 20.32,124.46 20.32,110.49 24.13,106.68 24.13,90.17 v25.4,88.9 | v27.94,76.2 v25.4,78.74 | v24.13,67.31 v27.94,67.31 | 8.89,38.1 10.16,39.37 30.48,39.37 | 11.43,54.61 11.43,49.53 10.16,48.26 3.81,48.26 | 3.81,48.26 3.81,39.37 5.08,38.1 8.89,38.1 | 30.48,39.37 C26.1
N$5
  Bottom 0.406: TOGURU.3 8.89,44.45 10.16,43.18 SW4.P$2
N$6
  Bottom 0.406: PWM10A.3 U$38.3
N$7  (via drill 0.6 pad 1.42)
  Top 0.406: v46.99,27.94 v53.34,27.94
  Bottom 0.406: U$3.16 R4.1
  Bottom 0.61: C11.P$1 C5.1 60.96,12.7 59.69,13.97 5V_REG1.P$3 59.69,20.32 53.34,26.67 v53.34,27.94 | R6.1 U$4.16 R5.1 46.99,55.88 | U$3.16 R3.1 40.64,88.9 40.64,100.33 38.1,102.87 | U$6.16 R2.1 7.62,34.29 R1.2 2.54,36.83 2.54,49.53 1.27,50.8 1.27,137.16 5.08,140.97 19.05,140.97 U$13.P$1 16.51,144.78 16.51,147.32 41.91,147.32 44.45,144.78 44.45,134.62 48.26,130.81 48.26,111.76 52.07,107.95 53.34,107.95 53.34,102.87 38.1,102.87 | 46.99,55.88 46.99,58.42 48.26,58.42 52.07,62.23 52.07,67.31 54.61,69.85 54.61,74.93 52.07,77.47 52.07,85.09 50.8,86.36 R4.1 | v46.99,27.94 49.53,30.48 49.53,46.99 52.07,49.53 52.07,50.8 49.53,53.34 46.99,53.34 46.99,55.88 | U$12.20 33.02,102.87 38.1,102.87
N$8
  Bottom 0.406: PWM10A.4 U$38.2
N$9
  Bottom 0.406: TOGURU.1 8.89,39.37 10.16,40.64 SW4.P$3
N$11
  Bottom 1.676: 44.45,11.43 41.91,11.43 | 46.99,8.89 44.45,11.43 | 46.99,8.89 46.99,7.62 | SW2.P$2 46.99,8.89 | 46.99,8.89 46.99,16.51 | 46.99,16.51 46.99,17.78 | 41.91,17.78 41.91,16.51 | 41.91,10.16 41.91,11.43 | 41.91,8.89 41.91,10.16 | 46.99,16.51 41.91,15.24 | 46.99,16.51 45.72,16.51 | 45.72,16.51 45.72,8.89 41.91,10.16 | 45.72,16.51 41.91,11.43 | 41.91,15.24 41.91,11.43 | 41.91,16.51 41.91,15.24 | SW2.P$3 44.45,8.89 44.45,11.43 | 41.91,16.51 45.72,16.51
  Bottom 1.93: 44.45,8.89 41.91,8.89 SW2.P$2 | 43.18,7.62 SW2.P$3 | 45.72,7.62 46.99,7.62 46.99,17.78 45.72,17.78 | 44.45,17.78 45.72,17.78 | 43.18,17.78 41.91,17.78 SW2.P$2 | SW2.P$2 43.18,7.62 | 43.18,7.62 43.18,17.78 | 43.18,17.78 44.45,17.78 | SW2.P$3 44.45,17.78 | SW2.P$3 45.72,7.62 | 45.72,7.62 45.72,17.78
N$12  (via drill 0.6 pad 1.42)
  Bottom 0.254: 31.11,10.79 31.75,11.43
  Bottom 0.406: C7.1 8.89,16.51
  Bottom 1.676: 52.07,24.13 U$2.P$1
  Bottom 1.778: C4.1 C10.P$1 50.8,7.62 48.26,5.08 39.37,5.08 SW2.P$1 | C28.1 31.75,15.24 C29.P$1
  Bottom 1.93: C13.P$1 C8.P$1 C7.1 | 52.07,24.13 54.61,21.59 5V_REG1.P$1 53.34,13.97 C4.1 | 15.24,11.43 5V_REG2.P$1 11.43,12.7 | 15.24,11.43 17.78,11.43 | 17.78,11.43 27.94,11.43 | 27.94,11.43 3.3V_REG.IN | 27.94,11.43 30.48,11.43 31.11,10.79 36.83,5.08 39.37,5.08 | 8.89,16.51 11.43,13.97 | 11.43,13.97 11.43,12.7 | 11.43,13.97 C3.1 | 17.78,11.43 5V_REG3.P$1 | 11.43,12.7 15.24,12.7 C3.1 | C3.1 15.24,11.43 | 35.56,6.35 31.75,10.16 31.75,11.43 C28.1
  other vias: 15.24,13.97
N$13
  Bottom 0.406: U$2.P$13 35.56,34.29 36.83,35.56 36.83,55.88 35.56,57.15 35.56,69.85 38.1,72.39 38.1,73.66 U$3.5
N$14
  Bottom 0.406: U$1.CN1_29 29.21,54.61 29.21,52.07 34.29,52.07 34.29,35.56 33.02,34.29 26.67,34.29 U$6.9
N$15  (via drill 0.6 pad 1.42)
  Top 0.406: v1.27,26.67 v5.08,26.67 | v1.27,46.99 v5.08,46.99
  Bottom 0.406: v5.08,26.67 6.35,26.67 U$6.1 | v1.27,26.67 v1.27,46.99 | U$1.CN1_27 22.86,58.42 21.59,57.15 21.59,46.99 v5.08,46.99
N$16  (via drill 0.6 pad 1.42)
  Top 0.406: v21.59,33.02 v24.13,33.02
  Bottom 0.406: U$1.CN1_28 34.29,57.15 34.29,53.34 35.56,52.07 35.56,35.56 33.02,33.02 v24.13,33.02 | v21.59,33.02 21.59,30.48 22.86,29.21 U$6.7
N$17
  Bottom 0.406: U$2.P$17 30.48,25.4 29.21,26.67 21.59,26.67 21.59,29.21 17.78,29.21 U$6.5
N$18
  Bottom 0.406: U$2.P$16 34.29,22.86 34.29,30.48 33.02,31.75 22.86,31.75 U$6.10
N$19
  Bottom 0.406: U$2.P$19 16.51,24.13 U$6.3
N$20
  Bottom 0.406: U$2.P$20 16.51,21.59 U$6.2
N$21  (via drill 0.6 pad 1.42)
  Top 0.406: v31.75,35.56 v31.75,30.48
  Bottom 0.406: v31.75,30.48 33.02,29.21 U$2.P$15 | v31.75,35.56 27.94,35.56 26.67,36.83 21.59,36.83 U$6.11
N$22
  Bottom 0.406: U$2.P$18 29.21,22.86 29.21,25.4 21.59,25.4 20.32,26.67 U$6.6
N$23  (via drill 0.6 pad 1.42)
  Top 0.406: v59.69,35.56 v59.69,41.91 | v46.99,35.56 v57.15,35.56
  Bottom 0.406: U$1.P$9 69.85,53.34 69.85,49.53 72.39,49.53 72.39,41.91 v59.69,41.91 | v57.15,35.56 v59.69,35.56 | U$4.7 46.99,40.64 v46.99,35.56
N$24  (via drill 0.6 pad 1.42)
  Top 0.406: v59.69,68.58 v64.77,68.58
  Bottom 0.406: v64.77,68.58 64.77,55.88 67.31,53.34 U$1.P$10 | v59.69,68.58 54.61,68.58 53.34,67.31 53.34,62.23 U$4.1
N$25  (via drill 0.5 pad 6.45)
  other vias: 3.81,3.81
N$26  (via drill 0.5 pad 6.45)
  other vias: 93.98,3.81
N$27
  Bottom 0.406: U$2.P$4 49.53,22.86 49.53,25.4 52.07,27.94 52.07,29.21 53.34,30.48 53.34,39.37 U$4.10
N$28
  Bottom 0.406: U$2.P$12 39.37,22.86 39.37,34.29 40.64,35.56 40.64,62.23 43.18,64.77 43.18,67.31 46.99,71.12 U$3.10
N$29
  Bottom 0.406: U$3.11 41.91,67.31 41.91,64.77 39.37,62.23 39.37,35.56 38.1,34.29 U$2.P$11
N$30
  Bottom 0.406: U$2.P$9 40.64,34.29 41.91,35.56 41.91,60.96 43.18,62.23 49.53,62.23 49.53,67.31 52.07,69.85 52.07,74.93 U$3.13
N$31  (via drill 0.6 pad 1.42)
  Top 0.406: v82.55,91.44 v73.66,91.44 | v81.28,57.15 v81.28,68.58 | v95.25,55.88 v83.82,55.88 | v63.5,2.54 v63.5,6.35
  Bottom 0.406: U$1.P$40 69.85,92.71 72.39,92.71 v73.66,91.44 | v81.28,68.58 81.28,78.74 82.55,80.01 v82.55,91.44 | v83.82,55.88 82.55,55.88 v81.28,57.15 | v63.5,2.54 86.36,2.54 87.63,3.81 87.63,5.08 92.71,10.16 93.98,10.16 95.25,11.43 v95.25,55.88 | U$4.9 54.61,39.37 54.61,26.67 62.23,19.05 62.23,13.97 63.5,12.7 v63.5,6.35
N$32
  Bottom 0.406: U$2.P$10 41.91,22.86 41.91,34.29 43.18,35.56 43.18,59.69 44.45,60.96 49.53,60.96 50.8,62.23 50.8,67.31 53.34,69.85 53.34,74.93 50.8,77.47 50.8,78.74 U$3.14
N$33
  Bottom 0.406: U$3.6 36.83,69.85 36.83,57.15 38.1,55.88 38.1,35.56 36.83,34.29 36.83,22.86 U$2.P$14
N$34
  Bottom 0.406: U$2.P$6 46.99,22.86 46.99,25.4 49.53,27.94 49.53,29.21 50.8,30.48 50.8,46.99 53.34,49.53 53.34,53.34 52.07,54.61 U$4.2
N$35
  Bottom 0.406: AN0.3 7.62,93.98 7.62,88.9 C18.1 10.16,86.36 16.51,86.36 21.59,81.28 21.59,72.39 22.86,71.12 U$1.CN1_17
N$36  (via drill 0.6 pad 1.42)
  Top 0.406: v54.61,63.5 v48.26,63.5
  Bottom 0.406: v48.26,63.5 U$3.9 | v54.61,63.5 58.42,63.5 58.42,49.53 63.5,44.45 69.85,44.45 U$1.P$1
N$37  (via drill 0.6 pad 1.42)
  Top 0.406: v53.34,81.28 v50.8,81.28 | v57.15,62.23 v57.15,73.66
  Bottom 0.406: v50.8,81.28 U$3.15 | v53.34,81.28 53.34,77.47 v57.15,73.66 | v57.15,62.23 57.15,48.26 62.23,43.18 U$1.P$2
N$38
  Bottom 0.406: R2.2 13.97,31.75 U$6.12
N$39
  Bottom 0.406: R1.1 15.24,29.21 U$6.4
N$40  (via drill 0.5 pad 6.45)
  other vias: 93.98,146.05
N$41
  Bottom 0.406: U$1.P$35 69.85,87.63 67.31,87.63 66.04,88.9 66.04,95.25 U$24.B6
N$42
  Bottom 0.406: R3.2 38.1,78.74 U$3.4
N$43
  Bottom 0.406: R4.2 U$3.12
N$44  (via drill 0.6 pad 1.42)
  Top 0.406: v38.1,66.04 v44.45,66.04 | v46.99,66.04 v54.61,66.04
  Bottom 0.406: U$3.7 38.1,68.58 v38.1,66.04 | v44.45,66.04 v46.99,66.04 | v54.61,66.04 59.69,66.04 59.69,50.8 64.77,45.72 U$1.P$4
N$45  (via drill 0.6 pad 1.42)
  Top 0.406: v45.72,33.02 v45.72,45.72
  Bottom 0.406: 45.72,31.75 U$2.P$5 v45.72,33.02 | v45.72,45.72 45.72,46.99 46.99,48.26 49.53,48.26 49.53,50.8 U$4.3
N$46
  Bottom 0.406: U$2.P$7 43.18,34.29 44.45,35.56 44.45,41.91 46.99,44.45 46.99,45.72 U$4.5
N$47
  Bottom 0.406: U$1.P$25 73.66,76.2 73.66,77.47 74.93,78.74 U$24.B3
N$48
  Bottom 0.406: U$4.4 45.72,52.07 R6.2 46.99,59.69
N$49
  Bottom 0.406: R5.2 U$4.12
N$50
  Bottom 0.406: U$2.P$3 48.26,25.4 50.8,27.94 50.8,29.21 52.07,30.48 52.07,41.91 54.61,44.45 U$4.11
N$51
  Bottom 0.406: U$1.P$26 69.85,72.39 72.39,72.39 73.66,73.66 73.66,74.93 74.93,76.2 74.93,77.47 76.2,78.74 76.2,95.25 U$24.B2
N$52
  Bottom 0.406: U$9.A6 88.9,74.93 88.9,64.77 90.17,63.5 90.17,12.7 86.36,8.89 MTU1.3 81.28,8.89 R7.2
N$53
  Bottom 0.406: U$9.A7 90.17,76.2 90.17,64.77 91.44,63.5 91.44,12.7 85.09,6.35 MTU1.4 78.74,6.35 R8.2
N$54  (via drill 0.5 pad 6.45)
  other vias: 3.81,146.05
N$55
  Bottom 0.406: U$9.A0 86.36,62.23 86.36,29.21 83.82,26.67 MTU8.3 77.47,30.48 77.47,35.56 R9.2
N$56
  Bottom 0.406: U$9.A1 87.63,63.5 87.63,26.67 85.09,24.13 MTU8.4 R10.2
N$57  (via drill 0.6 pad 1.42)
  Top 0.406: v74.93,19.05 v74.93,21.59
  Bottom 0.406: R11.2 71.12,8.89 MTU2.3 73.66,8.89 74.93,10.16 v74.93,19.05 | U$9.A4 87.63,71.12 87.63,64.77 88.9,63.5 88.9,25.4 85.09,21.59 v74.93,21.59
N$58
  Bottom 0.406: U$9.A5 83.82,77.47 83.82,82.55 86.36,82.55 91.44,77.47 91.44,64.77 92.71,63.5 92.71,12.7 85.09,5.08 72.39,5.08 | R12.2 73.66,19.05 73.66,10.16 68.58,10.16 67.31,8.89 67.31,5.08 72.39,5.08 | 72.39,5.08 MTU2.4
N$60
  Bottom 0.406: U$1.P$17 U$9.B0
N$61
  Bottom 0.406: U$9.A2 83.82,68.58 81.28,66.04 81.28,60.96 78.74,58.42 76.2,58.42 76.2,44.45 | R13.2 76.2,44.45 | 76.2,44.45 MTU7.3
N$62
  Bottom 0.406: U$9.A3 86.36,69.85 86.36,67.31 83.82,67.31 82.55,66.04 82.55,60.96 78.74,57.15 R14.2 78.74,55.88 78.74,48.26 81.28,48.26 82.55,46.99 82.55,43.18 81.28,41.91 MTU7.4
N$64
  Bottom 0.406: U$1.P$18 69.85,64.77 76.2,64.77 U$9.B1
N$65
  Bottom 0.406: U$1.P$19 74.93,66.04 U$9.B2
N$66
  Bottom 0.406: U$1.P$20 69.85,67.31 73.66,67.31 U$9.B3
N$67
  Bottom 0.406: U$1.P$21 72.39,68.58 U$9.B4
N$68
  Bottom 0.406: U$1.P$22 69.85,69.85 72.39,69.85 76.2,73.66 76.2,74.93 U$9.B5
N$69
  Bottom 0.406: U$1.P$23 72.39,71.12 74.93,73.66 74.93,74.93 76.2,76.2 76.2,77.47 U$9.B6
N$70
  Bottom 0.406: U$1.P$24 67.31,72.39 67.31,77.47 63.5,81.28 63.5,85.09 60.96,87.63 60.96,91.44 58.42,93.98 58.42,100.33 78.74,100.33 81.28,97.79 81.28,95.25 78.74,92.71 78.74,82.55 U$9.B7
N$71
  Bottom 0.406: U$1.CN1_4 36.83,92.71 U$12.4
N$72
  Bottom 0.406: U$1.CN1_3 29.21,90.17 29.21,96.52 27.94,97.79 27.94,100.33 29.21,101.6 36.83,101.6 U$12.5
N$77
  Bottom 0.406: U$1.CN1_2 34.29,92.71 U$12.3
N$78
  Bottom 0.406: U$1.CN1_1 30.48,97.79 U$12.2
N$79  (via drill 0.6 pad 1.42)
  Top 0.406: v50.8,87.63 v50.8,92.71
  Bottom 0.406: U$12.6 48.26,92.71 v50.8,92.71 | v50.8,87.63 53.34,85.09 53.34,83.82 59.69,77.47 59.69,71.12 60.96,69.85 60.96,52.07 66.04,46.99 69.85,46.99 U$1.P$5
N$80
  Bottom 0.406: U$1.P$6 66.04,48.26 62.23,52.07 62.23,69.85 60.96,71.12 60.96,77.47 54.61,83.82 54.61,90.17 52.07,92.71 52.07,93.98 48.26,97.79 45.72,97.79 U$12.7
N$81
  Bottom 0.406: U$1.P$7 72.39,52.07 72.39,54.61 67.31,54.61 66.04,55.88 66.04,69.85 63.5,72.39 63.5,77.47 57.15,83.82 57.15,90.17 54.61,92.71 54.61,93.98 50.8,97.79 50.8,100.33 46.99,100.33 U$12.8
N$82
  Bottom 0.406: U$1.P$8 67.31,50.8 63.5,54.61 63.5,69.85 62.23,71.12 62.23,77.47 55.88,83.82 55.88,90.17 53.34,92.71 53.34,93.98 49.53,97.79 U$12.9
N$83
  Bottom 0.406: U$13.P$5 24.13,132.08 22.86,130.81 22.86,116.84 R15.1 26.67,111.76 30.48,107.95 33.02,107.95 U$12.18
N$84
  Bottom 0.406: U$13.P$7 26.67,133.35 24.13,130.81 24.13,116.84 26.67,114.3 27.94,114.3 R16.1 31.75,110.49 34.29,110.49 36.83,107.95 U$12.17
N$85
  Bottom 0.406: U$13.P$9 29.21,134.62 25.4,130.81 25.4,116.84 26.67,116.84 29.21,114.3 30.48,114.3 R17.1 33.02,111.76 34.29,111.76 U$12.16
N$86
  Bottom 0.406: U$13.P$11 31.75,129.54 27.94,125.73 27.94,116.84 29.21,116.84 31.75,114.3 33.02,114.3 R18.1 39.37,107.95 40.64,107.95 U$12.15
N$87
  Bottom 0.406: U$13.P$13 34.29,127 35.56,125.73 35.56,114.3 R19.1 40.64,109.22 41.91,109.22 U$12.14
N$88
  Bottom 0.406: R22.2 LED1(PA7).A
N$89
  Bottom 0.406: U$13.P$17 39.37,135.89 45.72,129.54 45.72,116.84 R21.1 43.18,111.76 44.45,111.76 U$12.12
N$90
  Bottom 0.406: U$13.P$19 41.91,135.89 46.99,130.81 46.99,113.03 | R22.1 46.99,113.03 | U$12.11 46.99,111.76 46.99,113.03
N$91
  Bottom 0.406: U$13.P$15 36.83,129.54 38.1,128.27 38.1,114.3 R20.1 41.91,110.49 43.18,110.49 U$12.13
N$92
  Bottom 0.406: R21.2 LED2(PA6).A
N$93
  Bottom 0.406: R16.2 LED7(PD1).A
N$94
  Bottom 0.406: R15.2 LED8(PD0).A
N$95
  Bottom 0.406: R19.2 LED4(PA4).A
N$96
  Bottom 0.406: R17.2 LED6(PD3).A
N$97
  Bottom 0.406: R18.2 LED5(PD2).A
N$98
  Bottom 0.406: R20.2 LED3(PA5).A
N$101  (via drill 0.6 pad 1.42)
  Top 0.406: v39.37,92.71 v44.45,92.71 | v52.07,90.17 v63.5,90.17
  Bottom 0.406: U$1.CN1_25 31.75,59.69 34.29,59.69 34.29,71.12 35.56,72.39 35.56,80.01 36.83,81.28 36.83,90.17 v39.37,92.71 | v44.45,92.71 45.72,91.44 52.07,91.44 v52.07,90.17 | v63.5,90.17 63.5,97.79 72.39,97.79 U$24.B4
N$102
  Bottom 0.406: U$24.A2 78.74,105.41 83.82,105.41 R25.2 SCI0.1
N$103  (via drill 0.6 pad 1.42)
  Top 0.406: v73.66,93.98 v91.44,93.98
  Bottom 0.406: U$1.P$31 72.39,82.55 72.39,90.17 67.31,90.17 67.31,93.98 69.85,93.98 | 69.85,93.98 U$24.B5 | 69.85,93.98 v73.66,93.98 | v91.44,93.98 XBEE.1
N$107
  Bottom 0.406: U$24.A3 77.47,106.68 81.28,106.68 81.28,110.49 82.55,111.76 SCI0.2
N$108
  Bottom 0.406: R24.2 SCI1.1 72.39,106.68 U$24.A4
N$109
  Bottom 0.406: R23.2 SCI2.1 85.09,147.32 55.88,147.32 52.07,143.51 52.07,116.84 62.23,116.84 63.5,115.57 63.5,107.95 U$24.A6
N$110
  Bottom 0.406: U$1.CN1_16 31.75,72.39 24.13,72.39 22.86,73.66 22.86,81.28 16.51,87.63 11.43,87.63 8.89,90.17 8.89,104.14 7.62,105.41 PE7.2
N$111  (via drill 0.6 pad 1.42)
  Top 0.406: v11.43,107.95 v16.51,107.95
  Bottom 0.406: U$1.CN1_15 24.13,73.66 24.13,81.28 16.51,88.9 11.43,88.9 10.16,90.17 10.16,106.68 v11.43,107.95 | v16.51,107.95 PE6.2
N$112  (via drill 0.6 pad 1.42)
  Top 0.406: v55.88,106.68 v62.23,106.68
  Bottom 0.406: v62.23,106.68 U$24.A7 | v55.88,106.68 55.88,107.95 50.8,113.03 50.8,143.51 55.88,148.59 87.63,148.59 90.17,146.05 90.17,139.7 88.9,138.43 86.36,138.43 85.09,139.7 SCI2.2
N$113
  Bottom 0.406: U$24.A5 69.85,106.68 SCI1.2
N$114
  Bottom 0.406: U$1.CN1_20 31.75,69.85 22.86,69.85 20.32,72.39 20.32,81.28 19.05,82.55 AN3.3 15.24,83.82 C20.1
N$115
  Bottom 0.406: U$1.CN1_21 29.21,64.77 22.86,64.77 19.05,68.58 7.62,68.58 AN4.3 5.08,71.12 C23.1
N$116
  Bottom 0.406: U$1.CN1_22 31.75,67.31 29.21,67.31 29.21,66.04 22.86,66.04 19.05,69.85 AN5.3 C22.1
N$117  (via drill 0.6 pad 1.42)
  Top 0.406: v69.85,26.67 v69.85,31.75
  Bottom 0.406: v69.85,31.75 TR1.C | R26.2 v69.85,26.67
N$118
  Bottom 0.406: U$1.CN1_24 31.75,62.23 20.32,62.23 C25.1 16.51,58.42 AN7.3
N$120
  Bottom 0.406: U$1.CN1_12 35.56,81.28 35.56,85.09 29.21,85.09 26.67,87.63 26.67,96.52 25.4,97.79 25.4,106.68 21.59,110.49 21.59,130.81 SW3(PE3).P$1
N$121
  Bottom 0.406: U$1.CN1_13 17.78,88.9 17.78,91.44 15.24,91.44 12.7,93.98 12.7,114.3 13.97,115.57 PE4.2
N$122  (via drill 0.6 pad 1.42)
  Top 0.406: v16.51,110.49 v11.43,110.49
  Bottom 0.406: U$1.CN1_11 29.21,78.74 19.05,88.9 19.05,93.98 15.24,93.98 15.24,99.06 16.51,100.33 17.78,100.33 19.05,101.6 19.05,107.95 v16.51,110.49 | PE2.2 11.43,120.65 v11.43,110.49
N$123
  Bottom 0.406: U$1.CN1_10 31.75,82.55 29.21,82.55 22.86,88.9 22.86,106.68 19.05,110.49 19.05,123.19 PE1.2
N$124
  Bottom 0.406: U$1.CN1_9 29.21,81.28 21.59,88.9 21.59,106.68 17.78,110.49 17.78,116.84 8.89,125.73 8.89,133.35 PE0.2
N$125
  Bottom 0.406: R26.1 LED_RED.K
N$126
  Bottom 0.406: R27.1 71.12,35.56 TR1.B
N$127
  Bottom 0.406: U$1.P$11 72.39,55.88 73.66,54.61 73.66,41.91 72.39,40.64 R27.2
N$128
  Bottom 0.406: R28.1 64.77,30.48 LED_BLUE.K
N$129
  Bottom 0.406: TR2.C 59.69,30.48 R28.2
N$130
  Bottom 0.406: TR2.B 60.96,29.21 60.96,34.29 R29.1
N$131
  Bottom 0.406: U$1.P$12 69.85,57.15 73.66,57.15 74.93,55.88 74.93,41.91 72.39,39.37 63.5,39.37 R29.2
N$134
  Bottom 0.406: U$2.P$8 44.45,22.86 44.45,34.29 45.72,35.56 45.72,41.91 U$4.6
N$135
  Bottom 0.406: U$38.4 62.23,124.46 62.23,132.08 60.96,133.35 R31.2
N$136
  Bottom 0.406: R30.2 U$38.12
N$137  (via drill 0.6 pad 1.42)
  Top 0.406: v73.66,86.36 v83.82,86.36 | v60.96,135.89 v67.31,135.89 | v87.63,96.52 v93.98,96.52
  Bottom 0.406: U$1.P$29 73.66,81.28 v73.66,86.36 | v83.82,86.36 83.82,92.71 85.09,93.98 86.36,93.98 87.63,95.25 v87.63,96.52 | v67.31,135.89 67.31,134.62 69.85,132.08 69.85,129.54 U$38.15 | v60.96,135.89 60.96,137.16 59.69,138.43 58.42,138.43 57.15,139.7 57.15,143.51 59.69,146.05 83.82,146.05 83.82,138.43 85.09,137.16 88.9,137.16 93.98,132.08 v93.98,96.52
N$138  (via drill 0.6 pad 1.42)
  Top 0.406: v59.69,99.06 v59.69,105.41 | v59.69,109.22 v68.58,109.22
  Bottom 0.406: U$1.P$30 64.77,82.55 64.77,85.09 62.23,87.63 62.23,91.44 59.69,93.98 v59.69,99.06 | v59.69,105.41 v59.69,109.22 | v68.58,109.22 U$38.9
N$140
  Bottom 0.406: U$38.10 78.74,115.57 81.28,118.11 81.28,123.19 82.55,124.46 85.09,124.46 87.63,127 PWM4C.4
N$141
  Bottom 0.406: U$38.11 69.85,118.11 72.39,120.65 72.39,123.19 73.66,124.46 74.93,124.46 81.28,130.81 PWM4C.3
N$142
  Bottom 0.406: U$38.14 67.31,124.46 67.31,121.92 69.85,121.92 69.85,123.19 PWM4A.4
N$143
  Bottom 0.406: U$38.13 72.39,127 72.39,128.27 PWM4A.3
N$144
  Bottom 0.406: PWM10C.3 68.58,139.7 68.58,135.89 72.39,132.08 72.39,129.54 69.85,127 67.31,127 64.77,124.46 64.77,123.19 62.23,120.65 U$38.5
N$145
  Bottom 0.406: PWM10C.4 69.85,140.97 69.85,135.89 73.66,132.08 76.2,132.08 77.47,130.81 77.47,128.27 74.93,125.73 73.66,125.73 71.12,123.19 71.12,120.65 69.85,119.38 62.23,119.38 U$38.6
N$146
  Bottom 0.406: U$38.7 53.34,115.57 52.07,114.3 52.07,113.03 57.15,107.95 57.15,101.6 86.36,101.6 86.36,95.25 85.09,95.25 83.82,93.98 82.55,93.98 81.28,92.71 81.28,80.01 80.01,78.74 80.01,60.96 78.74,59.69 69.85,59.69 U$1.P$14
N$150
  Bottom 0.406: U$12.19 33.02,105.41 35.56,105.41 35.56,107.95 34.29,109.22 R32.2
N$151
  Bottom 0.406: U$12.1 30.48,100.33 33.02,100.33 33.02,95.25 31.75,93.98 31.75,87.63 29.21,87.63 27.94,88.9 27.94,96.52 26.67,97.79 R33.2
PE5  (via drill 0.6 pad 1.42)
  Top 0.406: v19.05,74.93 v25.4,74.93 | v2.54,85.09 v5.08,85.09
  Bottom 0.406: U$1.CN1_14 31.75,74.93 v25.4,74.93 | v5.08,85.09 6.35,85.09 10.16,81.28 10.16,76.2 17.78,76.2 v19.05,74.93 | v2.54,85.09 2.54,114.3 3.81,115.57 PE5.2
XBEE  (via drill 0.6 pad 1.42)  (1 unrouted)
  Top 0.406: v80.01,133.35 v80.01,137.16
  Bottom 0.406: C14.2 77.47,20.32 | 77.47,20.32 R8.1 R7.1 81.28,11.43 MTU1.2 | C15.2 80.01,20.32 77.47,20.32
  Bottom 0.61: R30.1 U$38.16 | 64.77,133.35 R31.1 | 64.77,133.35 62.23,135.89 PWM10C.2 63.5,144.78 68.58,144.78 69.85,143.51 77.47,143.51 | 64.77,133.35 R30.1 | PWM4A.2 v80.01,133.35 PWM4C.2 88.9,133.35 91.44,130.81 91.44,104.14 | R9.1 76.2,30.48 LED_RED.A 69.85,27.94 LED_BLUE.A | R14.1 77.47,46.99 MTU7.2 81.28,45.72 81.28,43.18 77.47,43.18 77.47,40.64 78.74,39.37 | MTU8.2 78.74,31.75 C16.2 78.74,38.1 | 78.74,38.1 78.74,39.37 | 85.09,53.34 U$9.VCCA | 85.09,53.34 85.09,38.1 82.55,38.1 R13.1 78.74,39.37 | 85.09,53.34 C17.2 | 73.66,38.1 73.66,35.56 76.2,33.02 R9.1 | R9.1 R10.1 | 73.66,38.1 78.74,38.1 | C9.P$1 C6.1 8.89,8.89 5V_REG2.P$3 11.43,3.81 13.97,1.27 27.94,1.27 29.21,2.54 59.69,2.54 60.96,3.81 85.09,3.81 93.98,12.7 93.98,63.5 92.71,64.77 92.71,77.47 86.36,83.82 86.36,91.44 91.44,96.52 91.44,104.14 | MTU2.2 R11.1 68.58,12.7 R12.1 | R12.1 63.5,13.97 63.5,20.32 | 63.5,20.32 C14.2 | 66.04,3.81 66.04,13.97 R12.1 | 73.66,38.1 57.15,38.1 55.88,36.83 55.88,26.67 57.15,25.4 60.96,25.4 63.5,22.86 63.5,20.32 | 91.44,104.14 U$24.VCCA | 77.47,143.51 R23.1 v80.01,137.16 | 77.47,143.51 SCI2.5 | PWM10A.2 55.88,121.92 62.23,121.92 63.5,123.19 63.5,129.54 R30.1
XBEE1  (via drill 0.6 pad 1.42)
  Top 0.406: v82.55,121.92 v82.55,127 | v30.48,3.81 v30.48,1.27 | v95.25,125.73 v90.17,125.73
  Bottom 0.813: 86.36,119.38 R25.1 82.55,120.65 v82.55,121.92 | SCI1.5 R24.1 80.01,124.46 v82.55,127 | 93.98,86.36 93.98,66.04 96.52,63.5 96.52,11.43 93.98,8.89 92.71,8.89 88.9,5.08 88.9,2.54 87.63,1.27 v30.48,1.27 | v30.48,3.81 C27.1 C30.P$1 24.13,6.35 5V_REG3.P$3 | 86.36,119.38 SCI0.5 | v90.17,125.73 86.36,121.92 86.36,119.38 | 93.98,86.36 93.98,92.71 95.25,93.98 v95.25,125.73 | 93.98,86.36 XBEE.3